# EAGLE schematic marionette (EAGLE 7.7.0), part 1 of 2
VERSION: 2.2

## Sheet 1 of 4: PWR
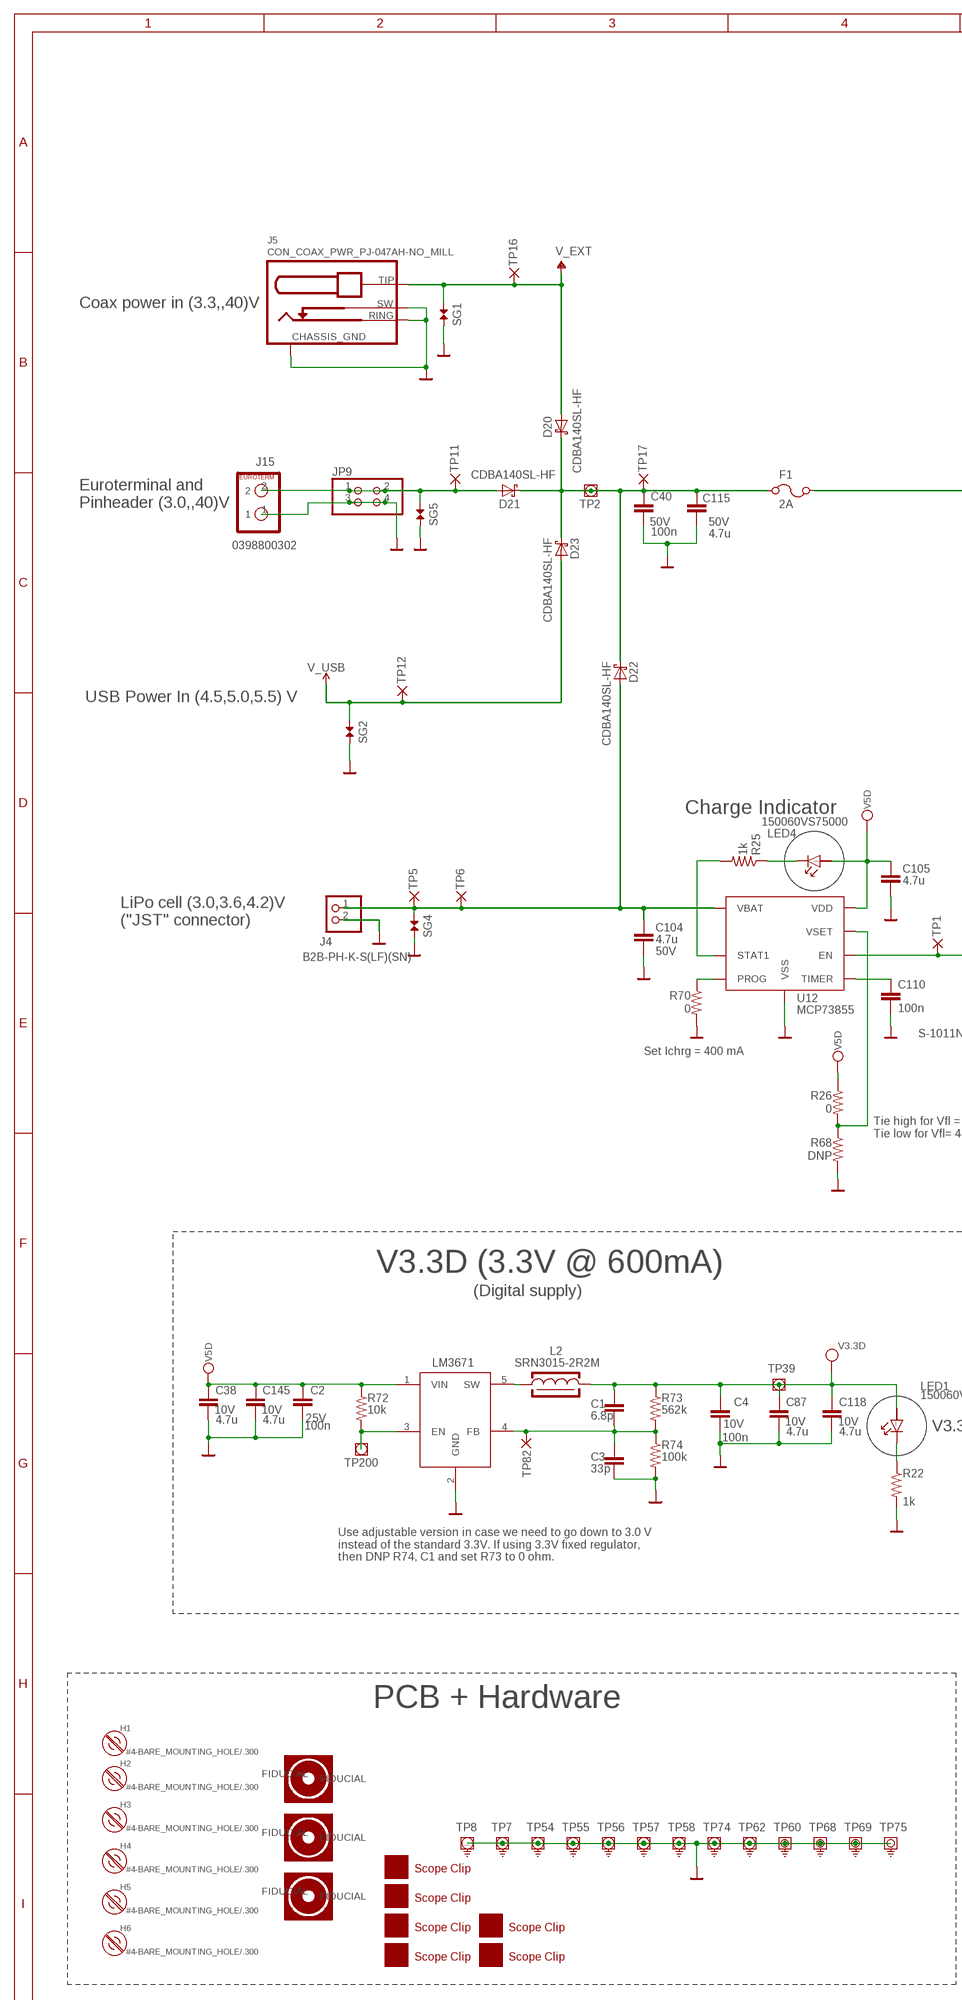
[diagram p0: schematic, sheet 1, part 1 of 2]
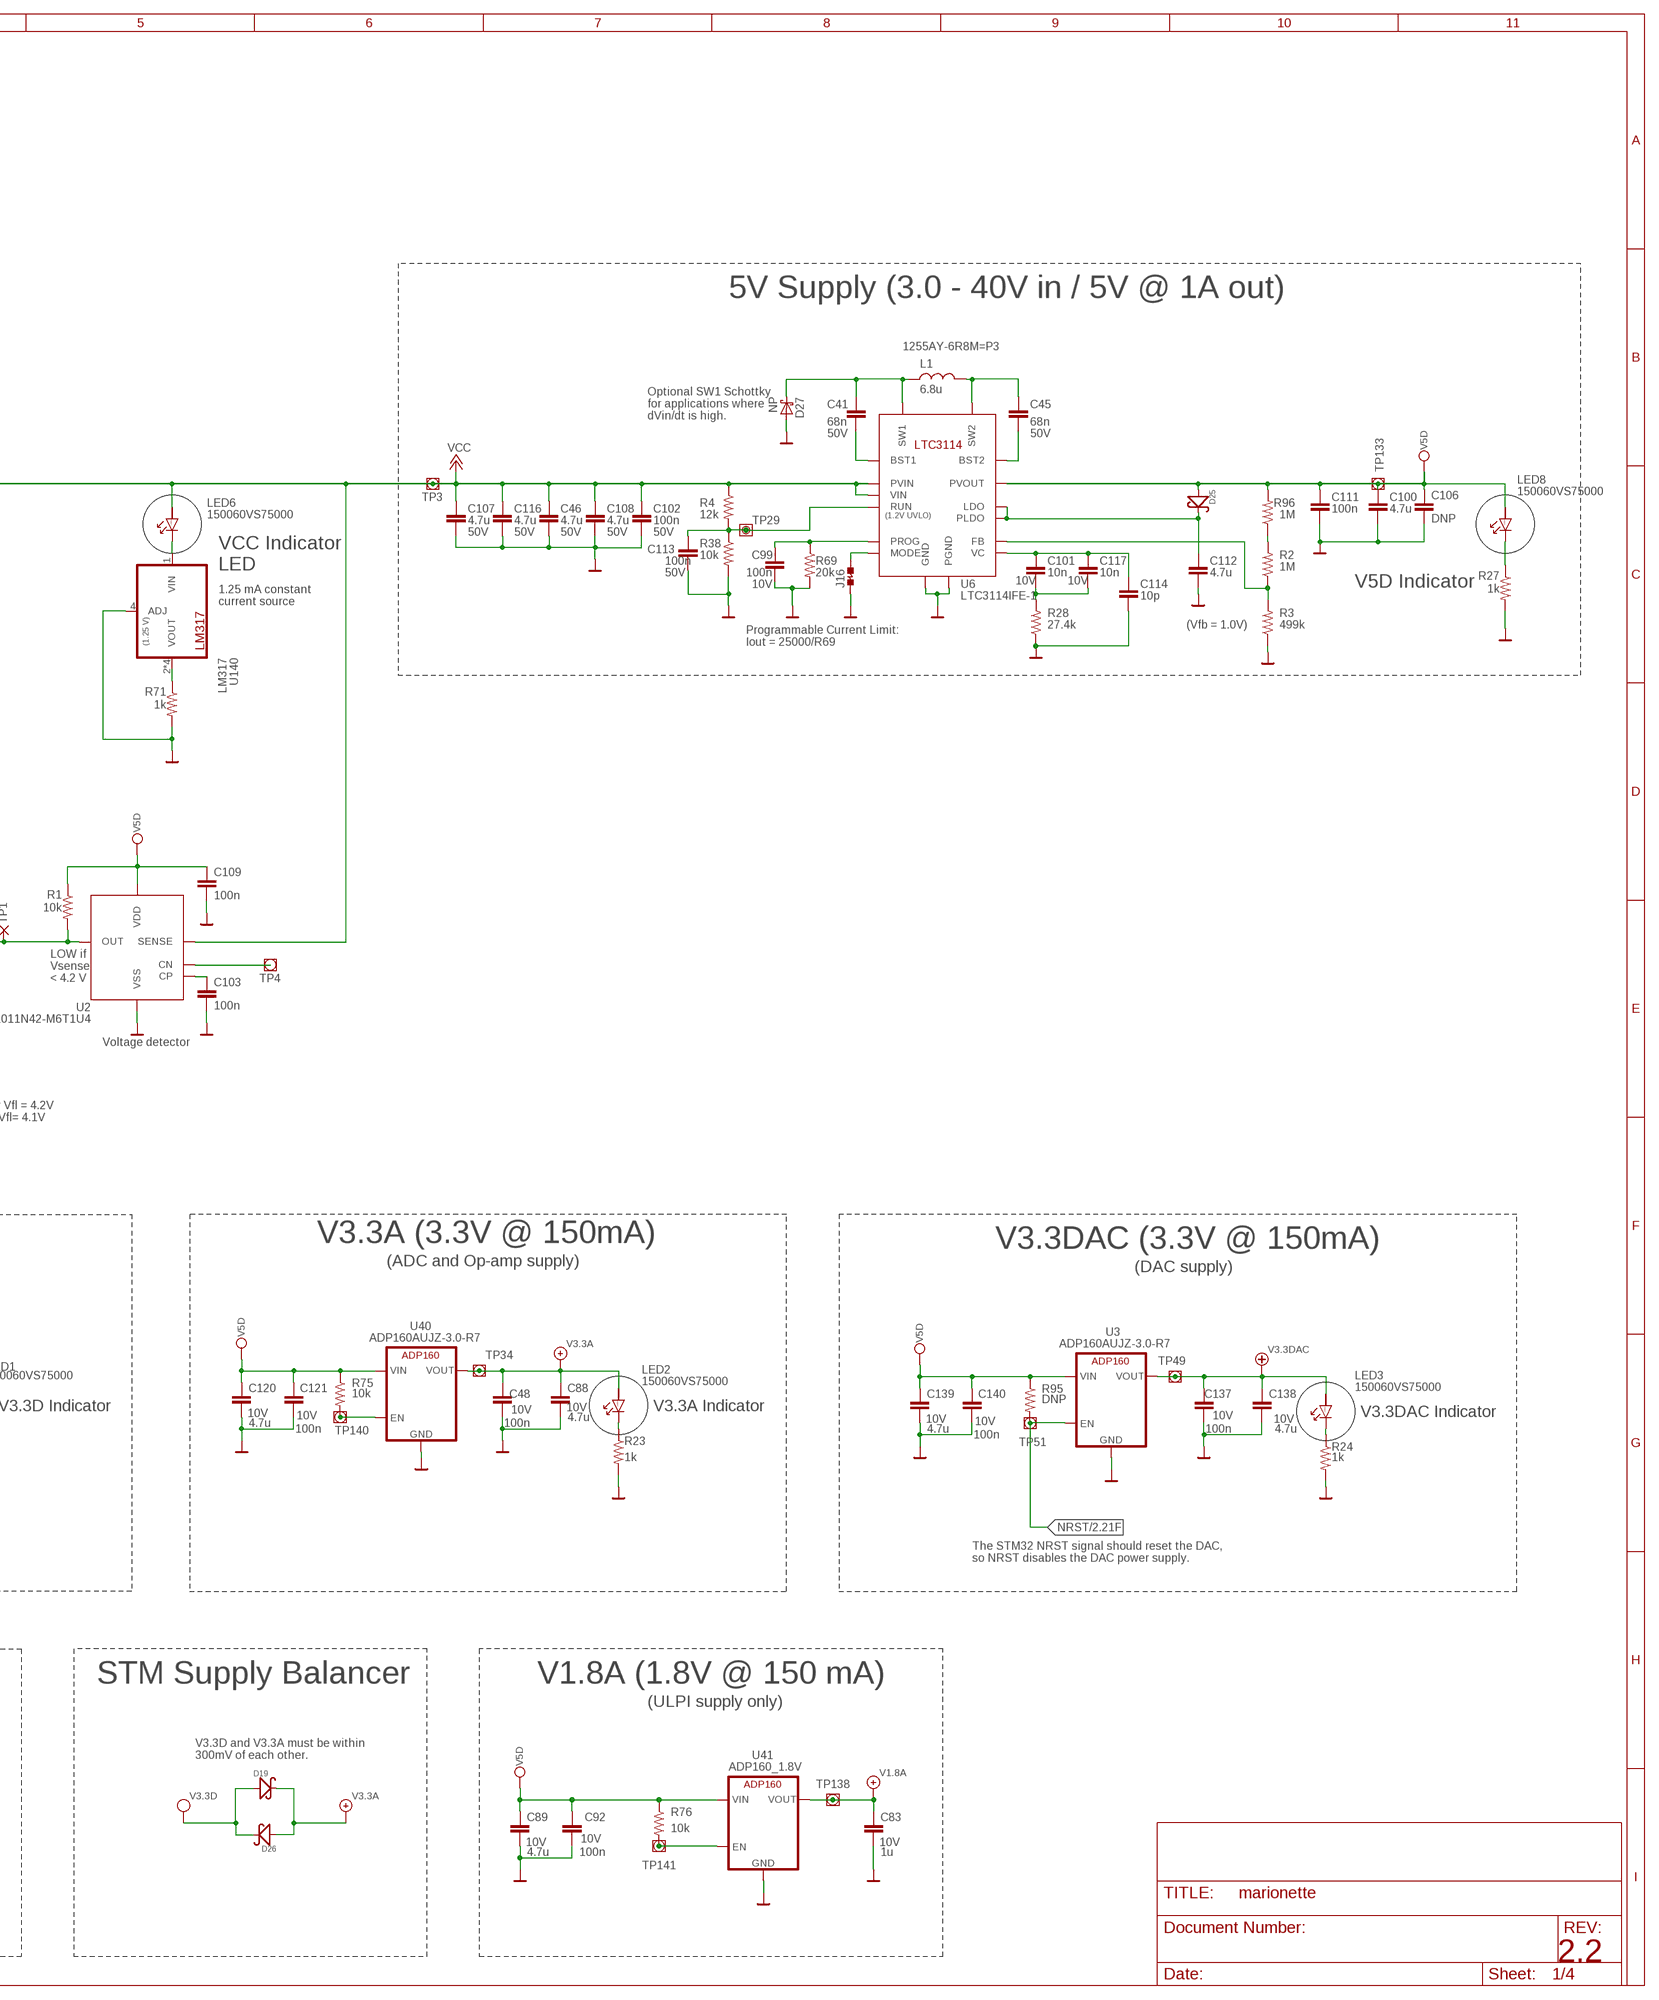
[diagram p1: schematic, sheet 1, part 2 of 2]

### Parts
C1  6.8p  C-EU0402-B  [.0402-B]
C2  100n  C-EU0402-B  [.0402-B]
C3  33p  C-EU0402-B  [.0402-B]
C4  100n  C-EU0402-B  [.0402-B]
C38  4.7u  C-EU0805-B  [.0805-B]
C40  100n  C-EU0402-B  [.0402-B]
C41  68n  C-EU0402-B  [.0402-B]
C45  68n  C-EU0402-B  [.0402-B]
C46  4.7u  C-EU0805-B  [.0805-B]
C48  100n  C-EU0402-B  [.0402-B]
C83  1u  C-EU0402-B  [.0402-B]
C87  4.7u  C-EU0805-B  [.0805-B]
C88  4.7u  C-EU0805-B  [.0805-B]
C89  4.7u  C-EU0805-B  [.0805-B]
C92  100n  C-EU0402-B  [.0402-B]
C99  100n  C-EU0402-B  [.0402-B]
C100  4.7u  C-EU0805-B  [.0805-B]
C101  10n  C-EU0402-B  [.0402-B]
C102  100n  C-EU0402-B  [.0402-B]
C103  100n  C-EU0402-B  [.0402-B]
C104  4.7u  C-EU0805-B  [.0805-B]
C105  4.7u  C-EU0805-B  [.0805-B]
C106  DNP  C-EU1206-B  [1206-B]
C107  4.7u  C-EU0805-B  [.0805-B]
C108  4.7u  C-EU0805-B  [.0805-B]
C109  100n  C-EU0402-B  [.0402-B]
C110  100n  C-EU0402-B  [.0402-B]
C111  100n  C-EU0402-B  [.0402-B]
C112  4.7u  C-EU0805-B  [.0805-B]
C113  100n  C-EU0402-B  [.0402-B]
C114  10p  C-EU0402-B  [.0402-B]
C115  4.7u  C-EU0805-B  [.0805-B]
C116  4.7u  C-EU0805-B  [.0805-B]
C117  10n  C-EU0402-B  [.0402-B]
C118  4.7u  C-EU0805-B  [.0805-B]
C120  4.7u  C-EU0805-B  [.0805-B]
C121  100n  C-EU0402-B  [.0402-B]
C137  100n  C-EU0402-B  [.0402-B]
C138  4.7u  C-EU0805-B  [.0805-B]
C139  4.7u  C-EU0805-B  [.0805-B]
C140  100n  C-EU0402-B  [.0402-B]
C145  4.7u  C-EU0805-B  [.0805-B]
D19  VSKY05201006-G4-08  DIODE-SCHOTTKY-0402  [.0402-B-NOSILK-DIODE]
D20  CDBA140SL-HF  DIODE_SCHOTTKY-_CDBA140SL-HF  [SMA]
D21  CDBA140SL-HF  DIODE_SCHOTTKY-_CDBA140SL-HF  [SMA]
D22  CDBA140SL-HF  DIODE_SCHOTTKY-_CDBA140SL-HF  [SMA]
D23  CDBA140SL-HF  DIODE_SCHOTTKY-_CDBA140SL-HF  [SMA]
D25  VSKY05201006-G4-08  DIODE-SCHOTTKY-0402  [.0402-B-NOSILK-DIODE]
D26  VSKY05201006-G4-08  DIODE-SCHOTTKY-0402  [.0402-B-NOSILK-DIODE]
D27  NP  DIODE_SCHOTTKY-_B130LB  [SMB]
F1  2A  FUSE-C1Q2  [R1206]
FIDUCIAL2  FIDUCIAL-1.0X2.0  [FIDUCIAL-1.0X2.0]
FIDUCIAL3  FIDUCIAL-1.0X2.0  [FIDUCIAL-1.0X2.0]
FIDUCIAL6  FIDUCIAL-1.0X2.0  [FIDUCIAL-1.0X2.0]
H1  #4-BARE_MOUNTING_HOLE/.300  [#4/.300-BARE+STD_NUT_OR_STAR_WASHER]
H2  #4-BARE_MOUNTING_HOLE/.300  [#4/.300-BARE+STD_NUT_OR_STAR_WASHER]
H3  #4-BARE_MOUNTING_HOLE/.300  [#4/.300-BARE+STD_NUT_OR_STAR_WASHER]
H4  #4-BARE_MOUNTING_HOLE/.300  [#4/.300-BARE+STD_NUT_OR_STAR_WASHER]
H5  #4-BARE_MOUNTING_HOLE/.300  [#4/.300-BARE+STD_NUT_OR_STAR_WASHER]
H6  #4-BARE_MOUNTING_HOLE/.300  [#4/.300-BARE+STD_NUT_OR_STAR_WASHER]
J4  B2B-PH-K-S(LF)(SN)  JST_2PIN-THM  [JST-PH-2-THM]
J5  CON_COAX_PWR_PJ-047AH-NO_MILL  [PJ-047_NO_MILLED_SLOTS]
J15  0398800302  CONN-TERM-EUROTERM_200MIL_2X1  [CONN-TERM-EUROSTYLE_200MIL_2X1]
J16  JUMPER-SHORTED-CUTTABLE-E0402-0.3MM-NOSILK  [JUMPER-SHORTED-CUTTABLE-E0402-0.3MM-NOSILK]
J17  SCOPE_CLIP_5MM_10MM  [SCOPE_CLIP_5MM_10MM]
J18  SCOPE_CLIP_5MM_10MM  [SCOPE_CLIP_5MM_10MM]
J19  SCOPE_CLIP_5MM_10MM  [SCOPE_CLIP_5MM_10MM]
J20  SCOPE_CLIP_5MM_10MM  [SCOPE_CLIP_5MM_10MM]
J24  SCOPE_CLIP_5MM_10MM  [SCOPE_CLIP_5MM_10MM]
J25  SCOPE_CLIP_5MM_10MM  [SCOPE_CLIP_5MM_10MM]
JP9  PINHD-2X2  [2X02]
L1  6.8u  L-US_1255AY_MURATA  [L_SHIELDED_6.3MM_6.3MM_4.5MM]
L2  SRN3015-2R2M  INDUCTOR_FERRITE_CORE_SRN3015-2R2M  [INDUCTOR_3MM_3MM_1.5MM]
LED1  150060VS75000  LS_Q976  [CHIPLED_0603]
LED2  150060VS75000  LS_Q976  [CHIPLED_0603]
LED3  150060VS75000  LS_Q976  [CHIPLED_0603]
LED4  150060VS75000  LS_Q976  [CHIPLED_0603]
LED6  150060VS75000  LS_Q976  [CHIPLED_0603]
LED8  150060VS75000  LS_Q976  [CHIPLED_0603]
R1  10k  R-US_0402-B  [.0402-B]
R2  1M  R-US_0402-B  [.0402-B]
R3  499k  R-US_0402-B  [.0402-B]
R4  12k  R-US_0402-B  [.0402-B]
R22  1k  R-US_0402-B  [.0402-B]
R23  1k  R-US_0402-B  [.0402-B]
R24  1k  R-US_0402-B  [.0402-B]
R25  1k  R-US_0402-B  [.0402-B]
R26  0  R-US_0402-B  [.0402-B]
R27  1k  R-US_0402-B  [.0402-B]
R28  27.4k  R-US_0402-B  [.0402-B]
R38  10k  R-US_0402-B  [.0402-B]
R68  DNP  R-US_0402-B  [.0402-B]
R69  20k  R-US_0402-B  [.0402-B]
R70  0  R-US_0402-B  [.0402-B]
R71  1k  R-US_0402-B  [.0402-B]
R72  10k  R-US_0402-B  [.0402-B]
R73  562k  R-US_0402-B  [.0402-B]
R74  100k  R-US_0402-B  [.0402-B]
R75  10k  R-US_0402-B  [.0402-B]
R76  10k  R-US_0402-B  [.0402-B]
R95  DNP  R-US_0402-B  [.0402-B]
R96  1M  R-US_0402-B  [.0402-B]
SG1  SPARKGAP_RECT_0.15MM  [SPARKGAP_0.15MM]
SG2  SPARKGAP_RECT_0.15MM  [SPARKGAP_0.15MM]
SG4  SPARKGAP_RECT_0.15MM  [SPARKGAP_0.15MM]
SG5  SPARKGAP_RECT_0.15MM  [SPARKGAP_0.15MM]
TP1  PAD+X-1.0-NO_CREAM+SILK  [PAD-ROUND-1.0-NOCREAM+SILK]
TP2  PAD+VIA_0.6MM  [PAD+VIA_0.6MM]
TP3  PAD+VIA_0.6MM  [PAD+VIA_0.6MM]
TP4  PAD+VIA_0.6MM  [PAD+VIA_0.6MM]
TP5  PAD+X-1.0-NO_CREAM+SILK  [PAD-ROUND-1.0-NOCREAM+SILK]
TP6  PAD+X-1.0-NO_CREAM+SILK  [PAD-ROUND-1.0-NOCREAM+SILK]
TP7  PAD+VIA_GND_0.6MM  [PAD+GND_VIA_0.6MM]
TP8  PAD+VIA_GND_0.6MM  [PAD+GND_VIA_0.6MM]
TP11  PAD+X-1.0-NO_CREAM+SILK  [PAD-ROUND-1.0-NOCREAM+SILK]
TP12  PAD+X-1.0-NO_CREAM+SILK  [PAD-ROUND-1.0-NOCREAM+SILK]
TP16  PAD+X-1.0-NO_CREAM+SILK  [PAD-ROUND-1.0-NOCREAM+SILK]
TP17  PAD+X-1.0-NO_CREAM+SILK  [PAD-ROUND-1.0-NOCREAM+SILK]
TP29  PAD+VIA_0.25MM  [PAD+VIA_0.25MM]
TP34  PAD+VIA_0.6MM  [PAD+VIA_0.6MM]
TP39  PAD+VIA_0.6MM  [PAD+VIA_0.6MM]
TP49  PAD+VIA_0.6MM  [PAD+VIA_0.6MM]
TP51  PAD+VIA_0.6MM  [PAD+VIA_0.6MM]
TP54  PAD+VIA_GND_0.6MM  [PAD+GND_VIA_0.6MM]
TP55  PAD+VIA_GND_0.6MM  [PAD+GND_VIA_0.6MM]
TP56  PAD+VIA_GND_0.6MM  [PAD+GND_VIA_0.6MM]
TP57  PAD+VIA_GND_0.6MM  [PAD+GND_VIA_0.6MM]
TP58  PAD+VIA_GND_0.6MM  [PAD+GND_VIA_0.6MM]
TP60  PAD+VIA_GND_0.25MM  [PAD+GND_VIA_0.25MM]
TP62  PAD+VIA_GND_0.6MM  [PAD+GND_VIA_0.6MM]
TP68  PAD+VIA_GND_0.25MM  [PAD+GND_VIA_0.25MM]
TP69  PAD+VIA_GND_0.25MM  [PAD+GND_VIA_0.25MM]
TP74  PAD+VIA_GND_0.6MM  [PAD+GND_VIA_0.6MM]
TP75  PAD+VIA_GND_0.25MM  [PAD+GND_VIA_0.25MM]
TP82  PAD+X-0.7-NO_CREAM+SILK  [PAD-ROUND-0.7-NOCREAM+SILK]
TP133  PAD+VIA_0.6MM  [PAD+VIA_0.6MM]
TP138  PAD+VIA_0.6MM  [PAD+VIA_0.6MM]
TP140  PAD+VIA_0.6MM  [PAD+VIA_0.6MM]
TP141  PAD+VIA_0.6MM  [PAD+VIA_0.6MM]
TP200  PAD+VIA_0.6MM  [PAD+VIA_0.6MM]
U2  S-1011N42-M6T1U4  S-1011N  [SOT23-6]
U3  ADP160AUJZ-3.0-R7  ADP160_3.3V  [SOT23-5]
U6  LTC3114IFE-1  LTC3114FE  [16-LEAD-PLASTIC-TSSOP-FE]
U12  MCP73855  [10-LEAD-DFN]
U17  LM3671  [SOT23-5L]
U40  ADP160AUJZ-3.0-R7  ADP160_3.3V  [SOT23-5]
U41  ADP160_1.8V  [SOT23-5]
U140  LM317  [SOIC-8]

### Nets
BST1: C41.1 U6.13(BST1)
BST2: C45.1 U6.12(BST2)
CHG-ENABLE: R1.2 TP1.PAD(P) U2.3(OUT) U12.10(EN)
CHRG_IND_CATHODE: LED4.C R25.1
CN: TP4.TP U2.6(CN)
CP: C103.1 U2.4(CP)
GND: C2.1 C3.1 C4.1 C38.2 C40.2 C46.2 C48.1 C83.2 C87.2 C88.2 C89.2 C92.1 C99.1 C100.2 C102.1 C103.2 C104.2 C105.2 C106.2 C107.2 C108.2 C109.2 C110.2 C111.1 C112.2 C113.1 C114.1 C115.2 C116.2 C118.2 C120.2 C121.1 C137.1 C138.2 C139.2 C140.1 C145.2 D27.ANODE J4.2 J5.RING J5.S1(CHASSIS_GND) J5.S2(CHASSIS_GND) J5.SWITCH(SW) J15.1 J16.1 JP9.3 JP9.4 R3.1 R22.2 R23.2 R24.2 R27.2 R28.1 R38.2 R68.2 R69.2 R70.2 R71.2 R74.2 SG1.2 SG2.2 SG4.2 SG5.2 TP7.TP TP8.TP TP54.TP TP55.TP TP56.TP TP57.TP TP58.TP TP60.TP TP62.TP TP68.TP TP69.TP TP74.TP TP75.TP U2.5(VSS) U3.2(GND) U3.4(GND) U6.1(PGND) U6.8(GND) U6.PAD(PGND) U12.4(VSS) U12.7(VSS) U12.EP(VSS) U17.2(GND) U40.2(GND) U40.4(GND) U41.2(GND) U41.4(GND) U140.4(ADJ) ; also sheet 2,3,4
LED_CATH_V3.3A: LED2.C R23.1
LED_CATH_V3.3D: LED1.C R22.1
LED_CATH_V3.3DAC: LED3.C R24.1
LM3671_EN: R72.2 TP200.TP U17.3(EN)
LM3671_FB: C1.1 C3.2 R73.2 R74.1 TP82.PAD(P) U17.4(FB)
LM3671_SW: L2.2 U17.5(SW)
LTC3114_FB: R2.1 R3.2 U6.7(FB)
LTC3114_LDO: C112.1 D25.C(-) U6.9(LDO) U6.11(PLDO)
LTC3114_MODE: J16.2 U6.16(MODE)
LTC3114_PROG: C99.2 R69.1 U6.5(PROG)
LTC3114_RUN: C113.2 R4.2 R38.1 TP29.TP U6.4(RUN)
LTC3114_VC: C101.2 C114.2 C117.2 U6.6(VC)
LTC3114_VC1: C101.1 C117.1 R28.2
MCP73855_PROG: R70.1 U12.5(PROG)
MCP73855_STAT1: R25.2 U12.1(STAT1)
MCP73855_VSET: R26.2 R68.1 U12.2(VSET)
MIC5305_V1.8A_EN: R76.2 TP141.TP U41.3(EN)
MIC5305_V3.3_EN: R75.2 TP140.TP U40.3(EN)
NRST: R95.2 TP51.TP U3.3(EN) ; also sheet 2
SW1: C41.2 D27.CATH(CATHODE) L1.1 U6.15(SW1)
SW2: C45.2 L1.2 U6.2(SW2)
TIMER: C110.1 U12.6(TIMER)
V1.8A: C83.1 TP138.TP U41.5(VOUT) ; also sheet 2,4
V3.3A: C48.2 C88.1 D19.C(-) D26.A(+) LED2.A TP34.TP U40.5(VOUT) ; also sheet 2,3,4
V3.3D: C1.2 C4.2 C87.1 C118.1 D19.A(+) D26.C(-) L2.1 LED1.A R73.1 TP39.TP ; also sheet 2,4
V3.3DAC: C137.2 C138.1 LED3.A TP49.TP U3.5(VOUT) ; also sheet 3
V5D: C2.2 C38.1 C89.1 C92.2 C100.1 C105.1 C106.1 C109.1 C111.2 C120.1 C121.2 C139.1 C140.2 C145.1 D25.A(+) LED4.A LED8.A R1.1 R26.1 R72.1 R75.1 R76.1 R95.1 R96.2 TP133.TP U2.1(VDD) U3.1(VIN) U6.3(PVOUT) U12.3(VDD) U17.1(VIN) U40.1(VIN) U41.1(VIN) ; also sheet 2,4
V5D_CATHODE: LED8.C R27.1
V5D_FB_R: R2.2 R96.1
V_EXT: D20.A(ANODE) J5.TIP SG1.1 TP16.PAD(P)
V_USB [med-isolate]: D23.A(ANODE) SG2.1 TP12.PAD(P) ; also sheet 2
VBAT: C104.1 D22.A(ANODE) J4.1 SG4.1 TP5.PAD(P) TP6.PAD(P) U12.8(VBAT) U12.9(VBAT)
VCC: C46.1 C102.2 C107.1 C108.1 C116.1 F1.2 LED6.A R4.1 TP3.TP U2.2(SENSE) U6.10(VIN) U6.14(PVIN) ; also sheet 4
VCC_CATHODE: LED6.C U140.1(VIN)
VCC_LED: R71.1 U140.2(VOUT) U140.3(VOUT) U140.6(VOUT) U140.7(VOUT)
VIN [med-isolate]: C40.1 C115.1 D20.K(CATHODE) D21.K(CATHODE) D22.K(CATHODE) D23.K(CATHODE) F1.1 TP2.TP TP17.PAD(P)
VIN_EUROTERMINAL [med-isolate]: D21.A(ANODE) J15.2 JP9.1 JP9.2 SG5.1 TP11.PAD(P)
Unconnected: FIDUCIAL2.FIDUCIAL FIDUCIAL3.FIDUCIAL FIDUCIAL6.FIDUCIAL

### Notes on the sheet
- 5V Supply (3.0 - 40V in / 5V @ 1A out)
- Coax power in (3.3,,40)V
- 1255AY-6R8M=P3
- Optional SW1 Schottky 
  for applications where 
  dVin/dt is high.
- Euroterminal and 
  Pinheader (3.0,,40)V
- (1.2V UVLO)
- VCC Indicator
  LED
- V5D Indicator
- 1.25 mA constant
  current source
- (Vfb = 1.0V)
- Programmable Current Limit:
  Iout = 25000/R69
- USB Power In (4.5,5.0,5.5) V
- Charge Indicator
- LiPo cell (3.0,3.6,4.2)V
  ("JST" connector)
- LOW if 
  Vsense 
  < 4.2 V
- Set Ichrg = 400 mA
- Voltage detector
- Tie high for Vfl = 4.2V
  Tie low for Vfl= 4.1V
- V3.3A (3.3V @ 150mA) | V3.3DAC (3.3V @ 150mA)
- V3.3D (3.3V @ 600mA)
- (ADC and Op-amp supply)
- (DAC supply)
- (Digital supply)
- V3.3D Indicator | V3.3A Indicator
- V3.3DAC Indicator
- Use adjustable version in case we need to go down to 3.0 V
  instead of the standard 3.3V. If using 3.3V fixed regulator,
  then DNP R74, C1 and set R73 to 0 ohm.
- The STM32 NRST signal should reset the DAC, 
  so NRST disables the DAC power supply.
- PCB + Hardware | STM Supply Balancer | V1.8A (1.8V @ 150 mA)
- (ULPI supply only)
- V3.3D and V3.3A must be within
  300mV of each other.

## Sheet 2 of 4: STM
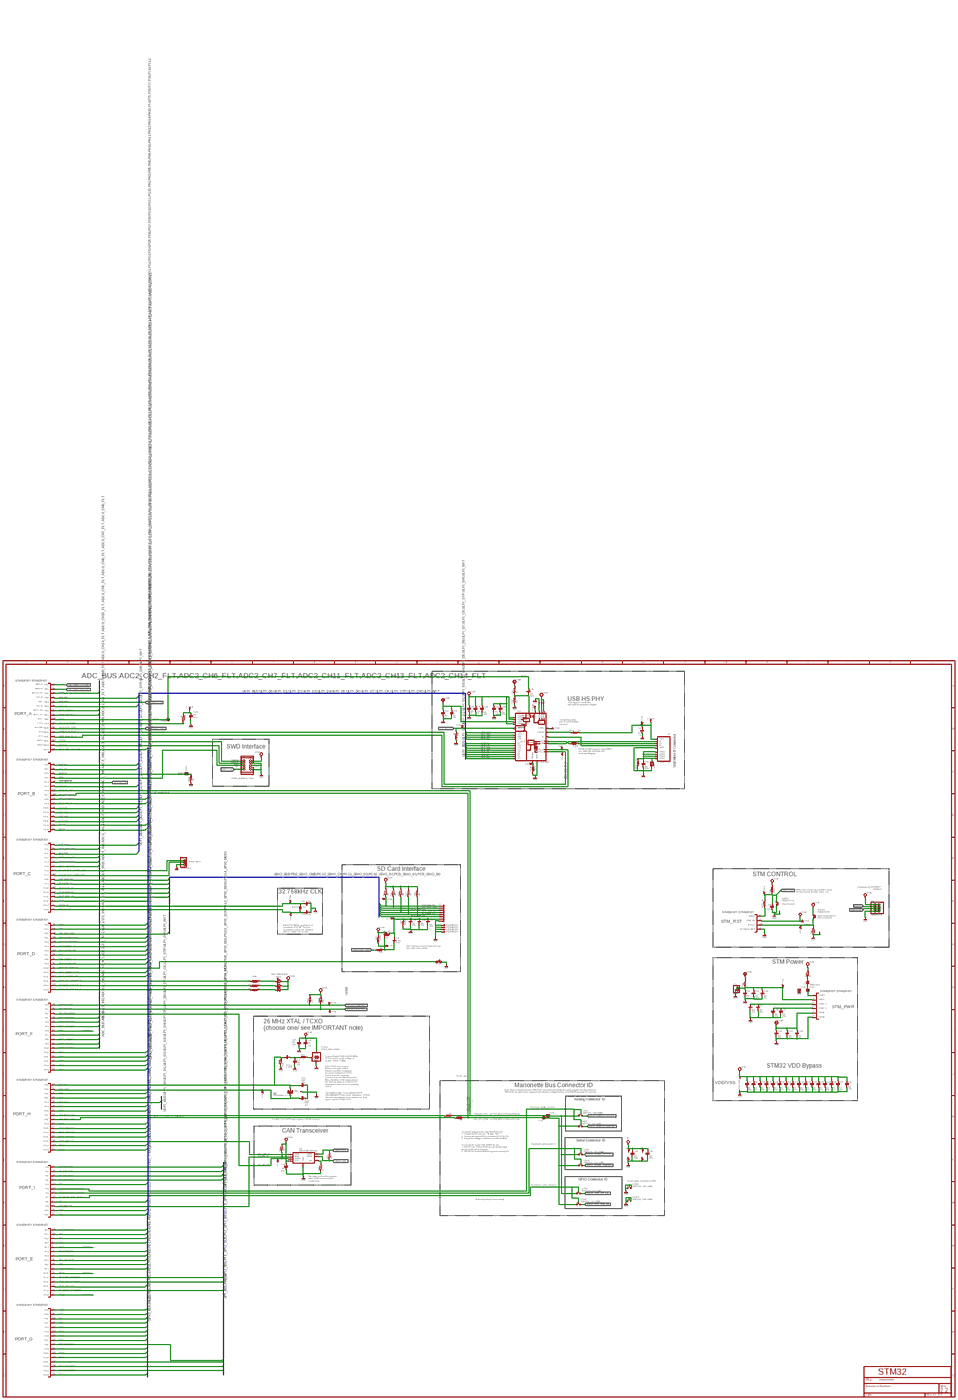
[diagram p2: schematic, sheet 2, overview]
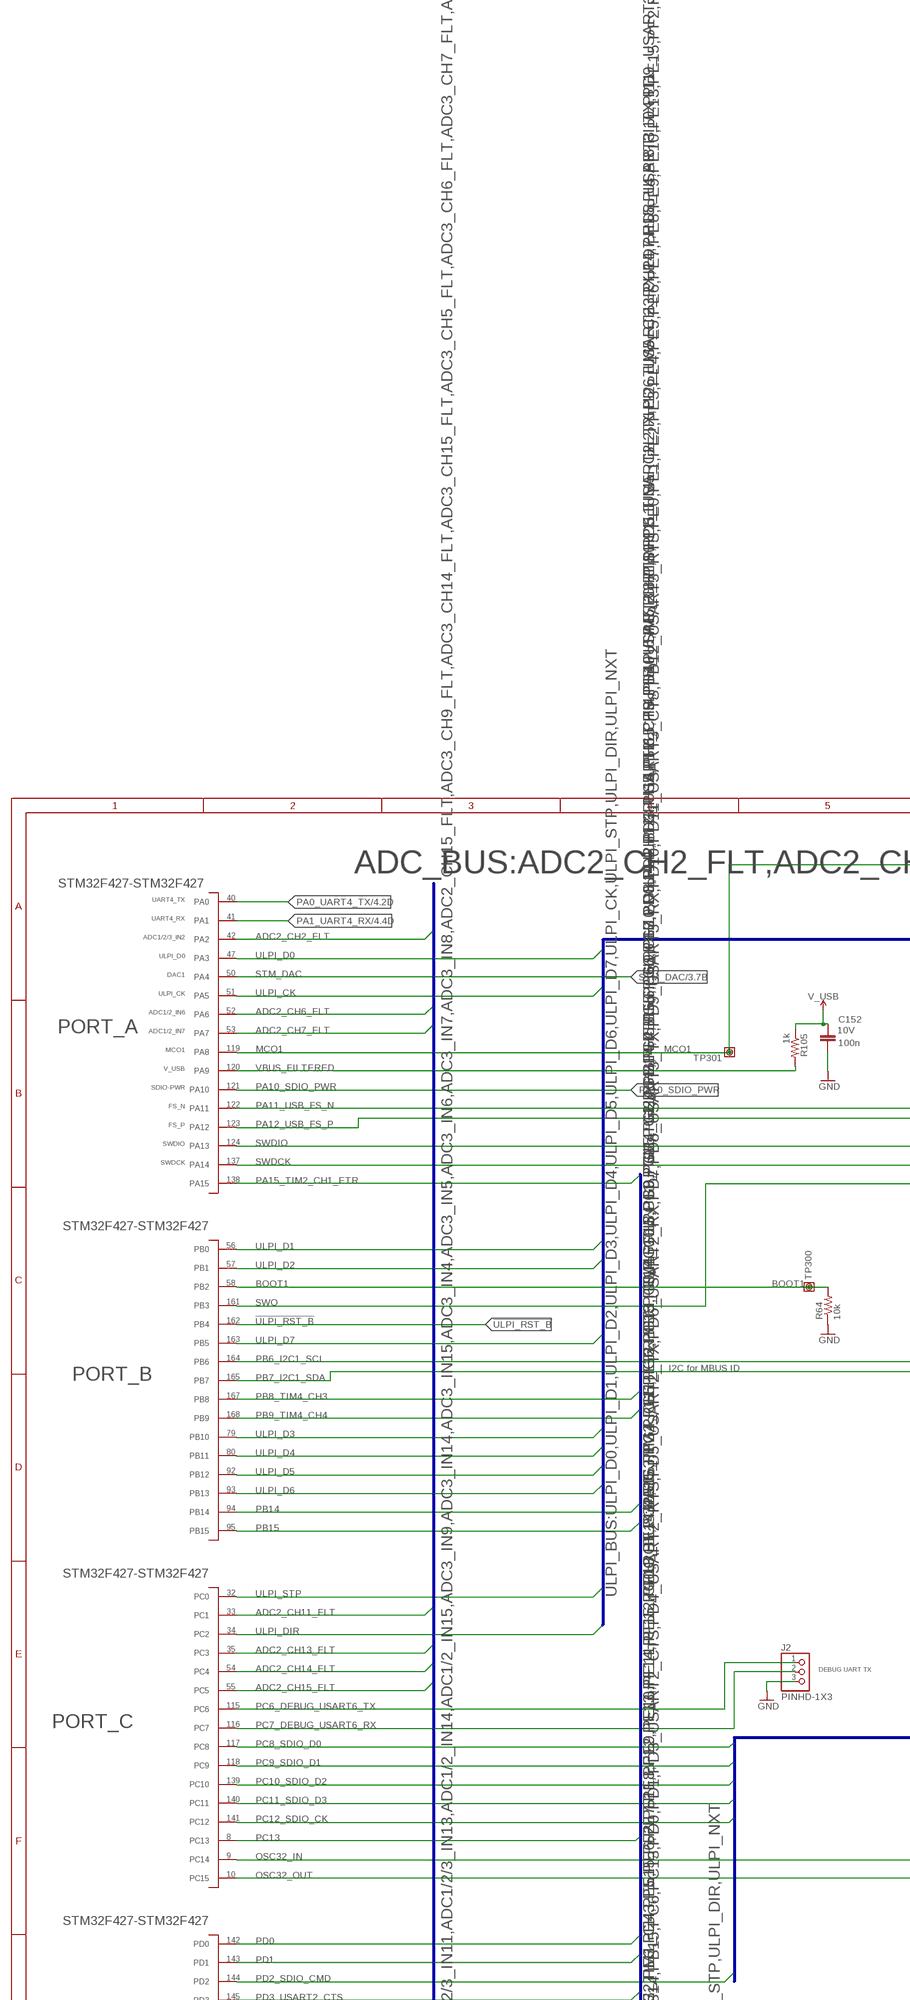
[diagram p3: schematic, sheet 2, part 1 of 6]
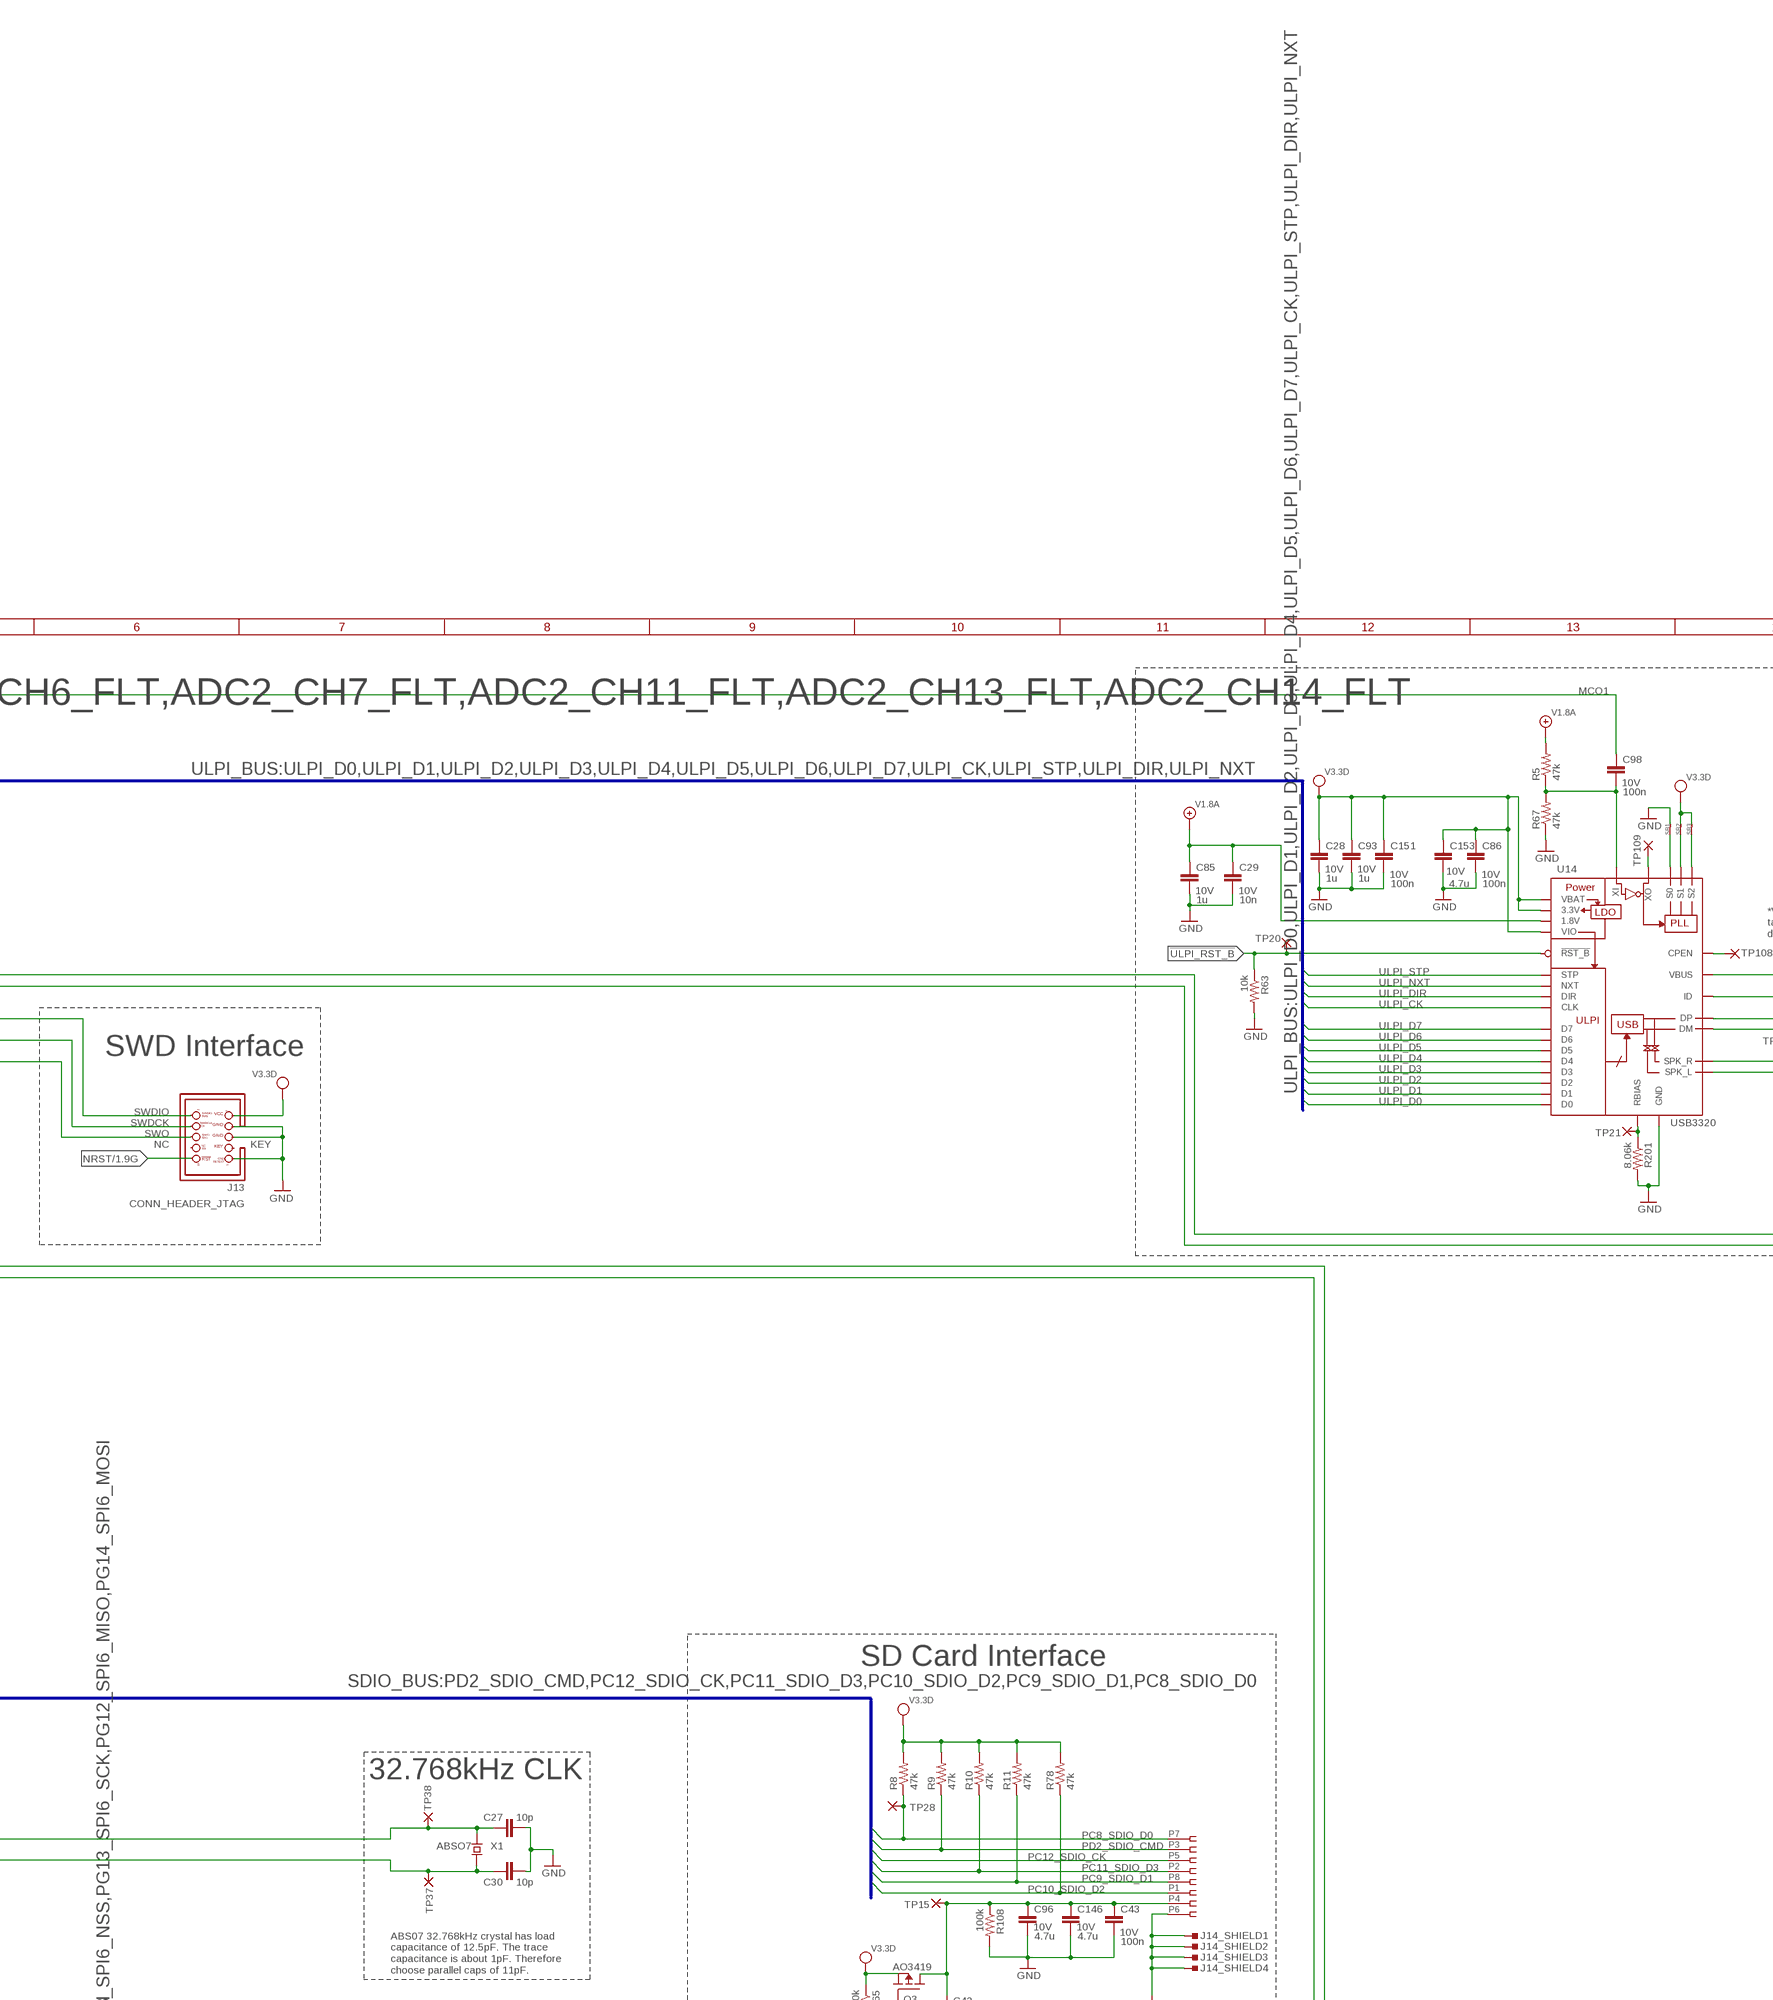
[diagram p4: schematic, sheet 2, part 2 of 6]
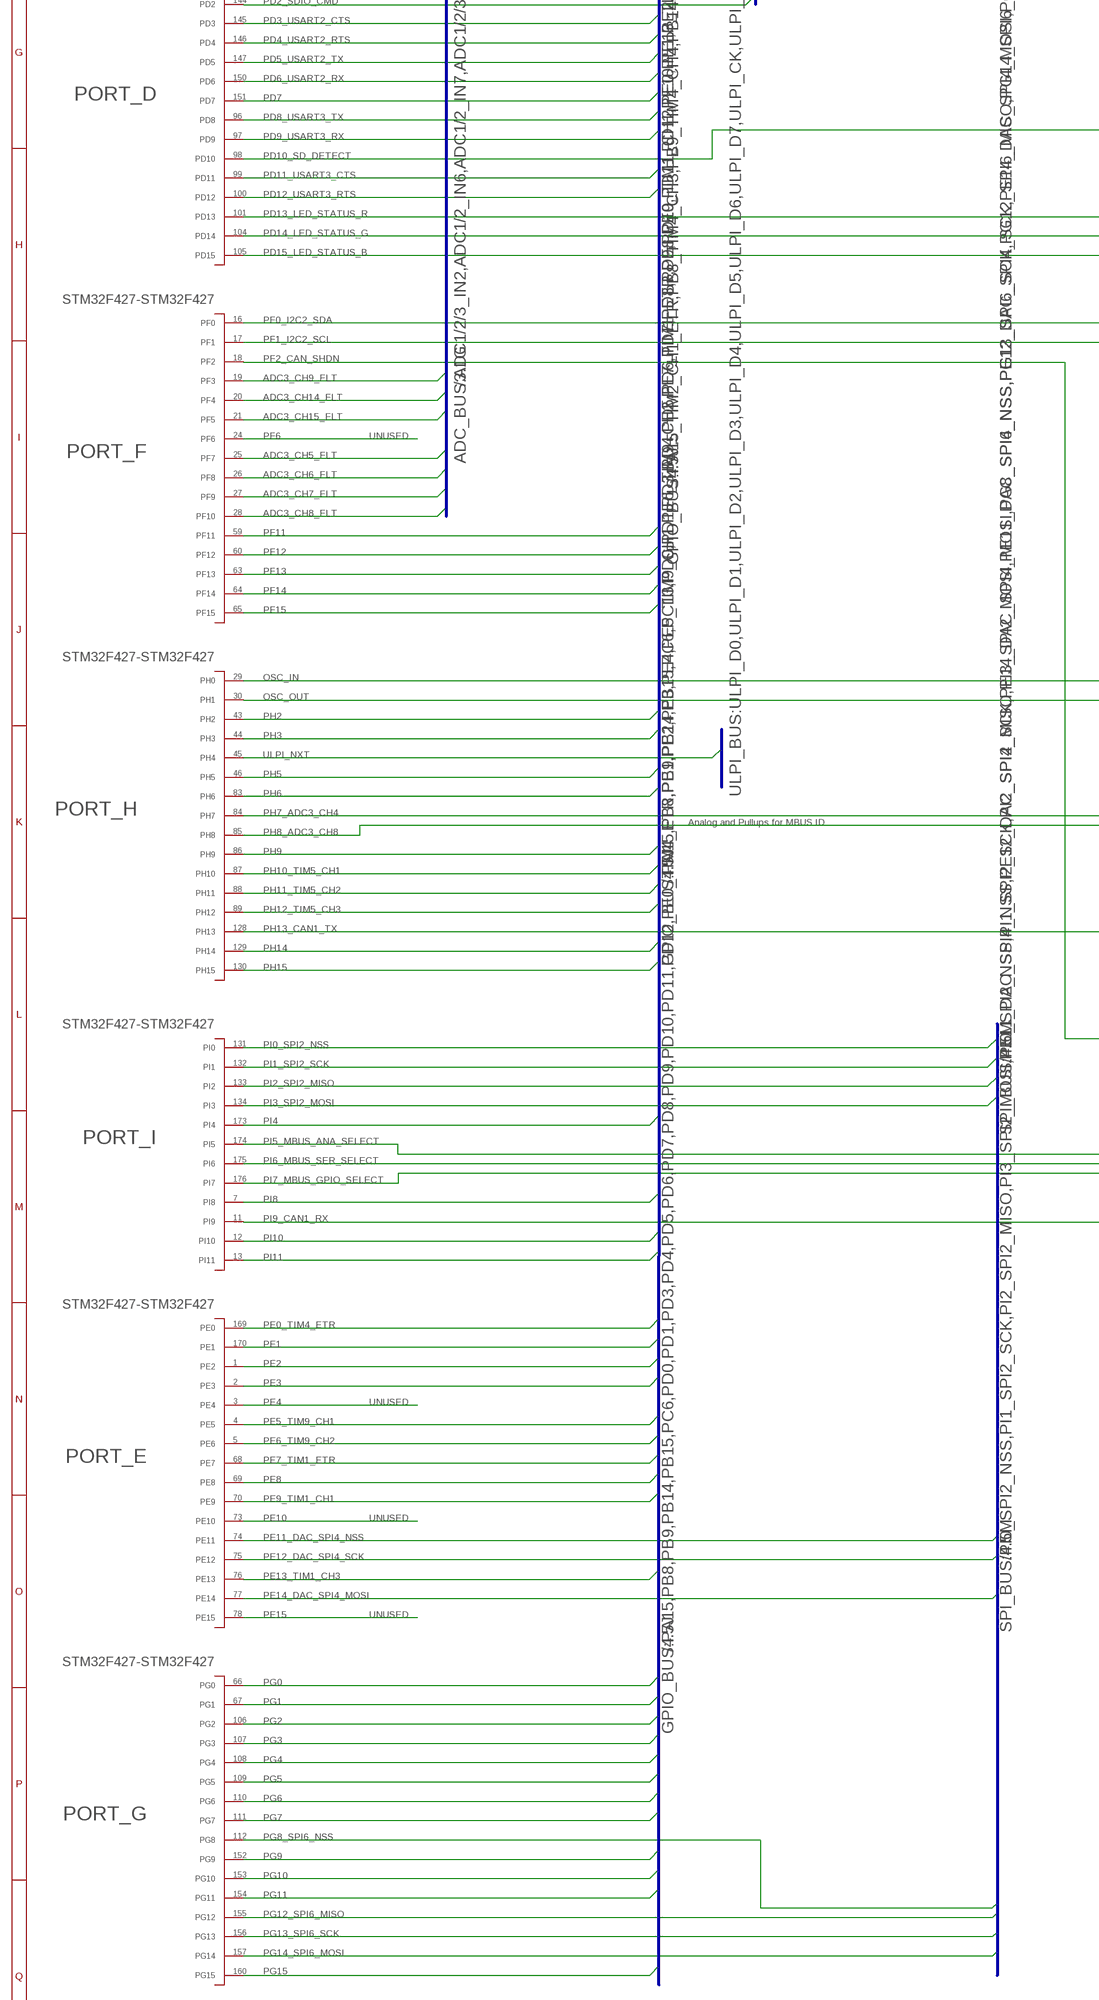
[diagram p5: schematic, sheet 2, part 3 of 6]
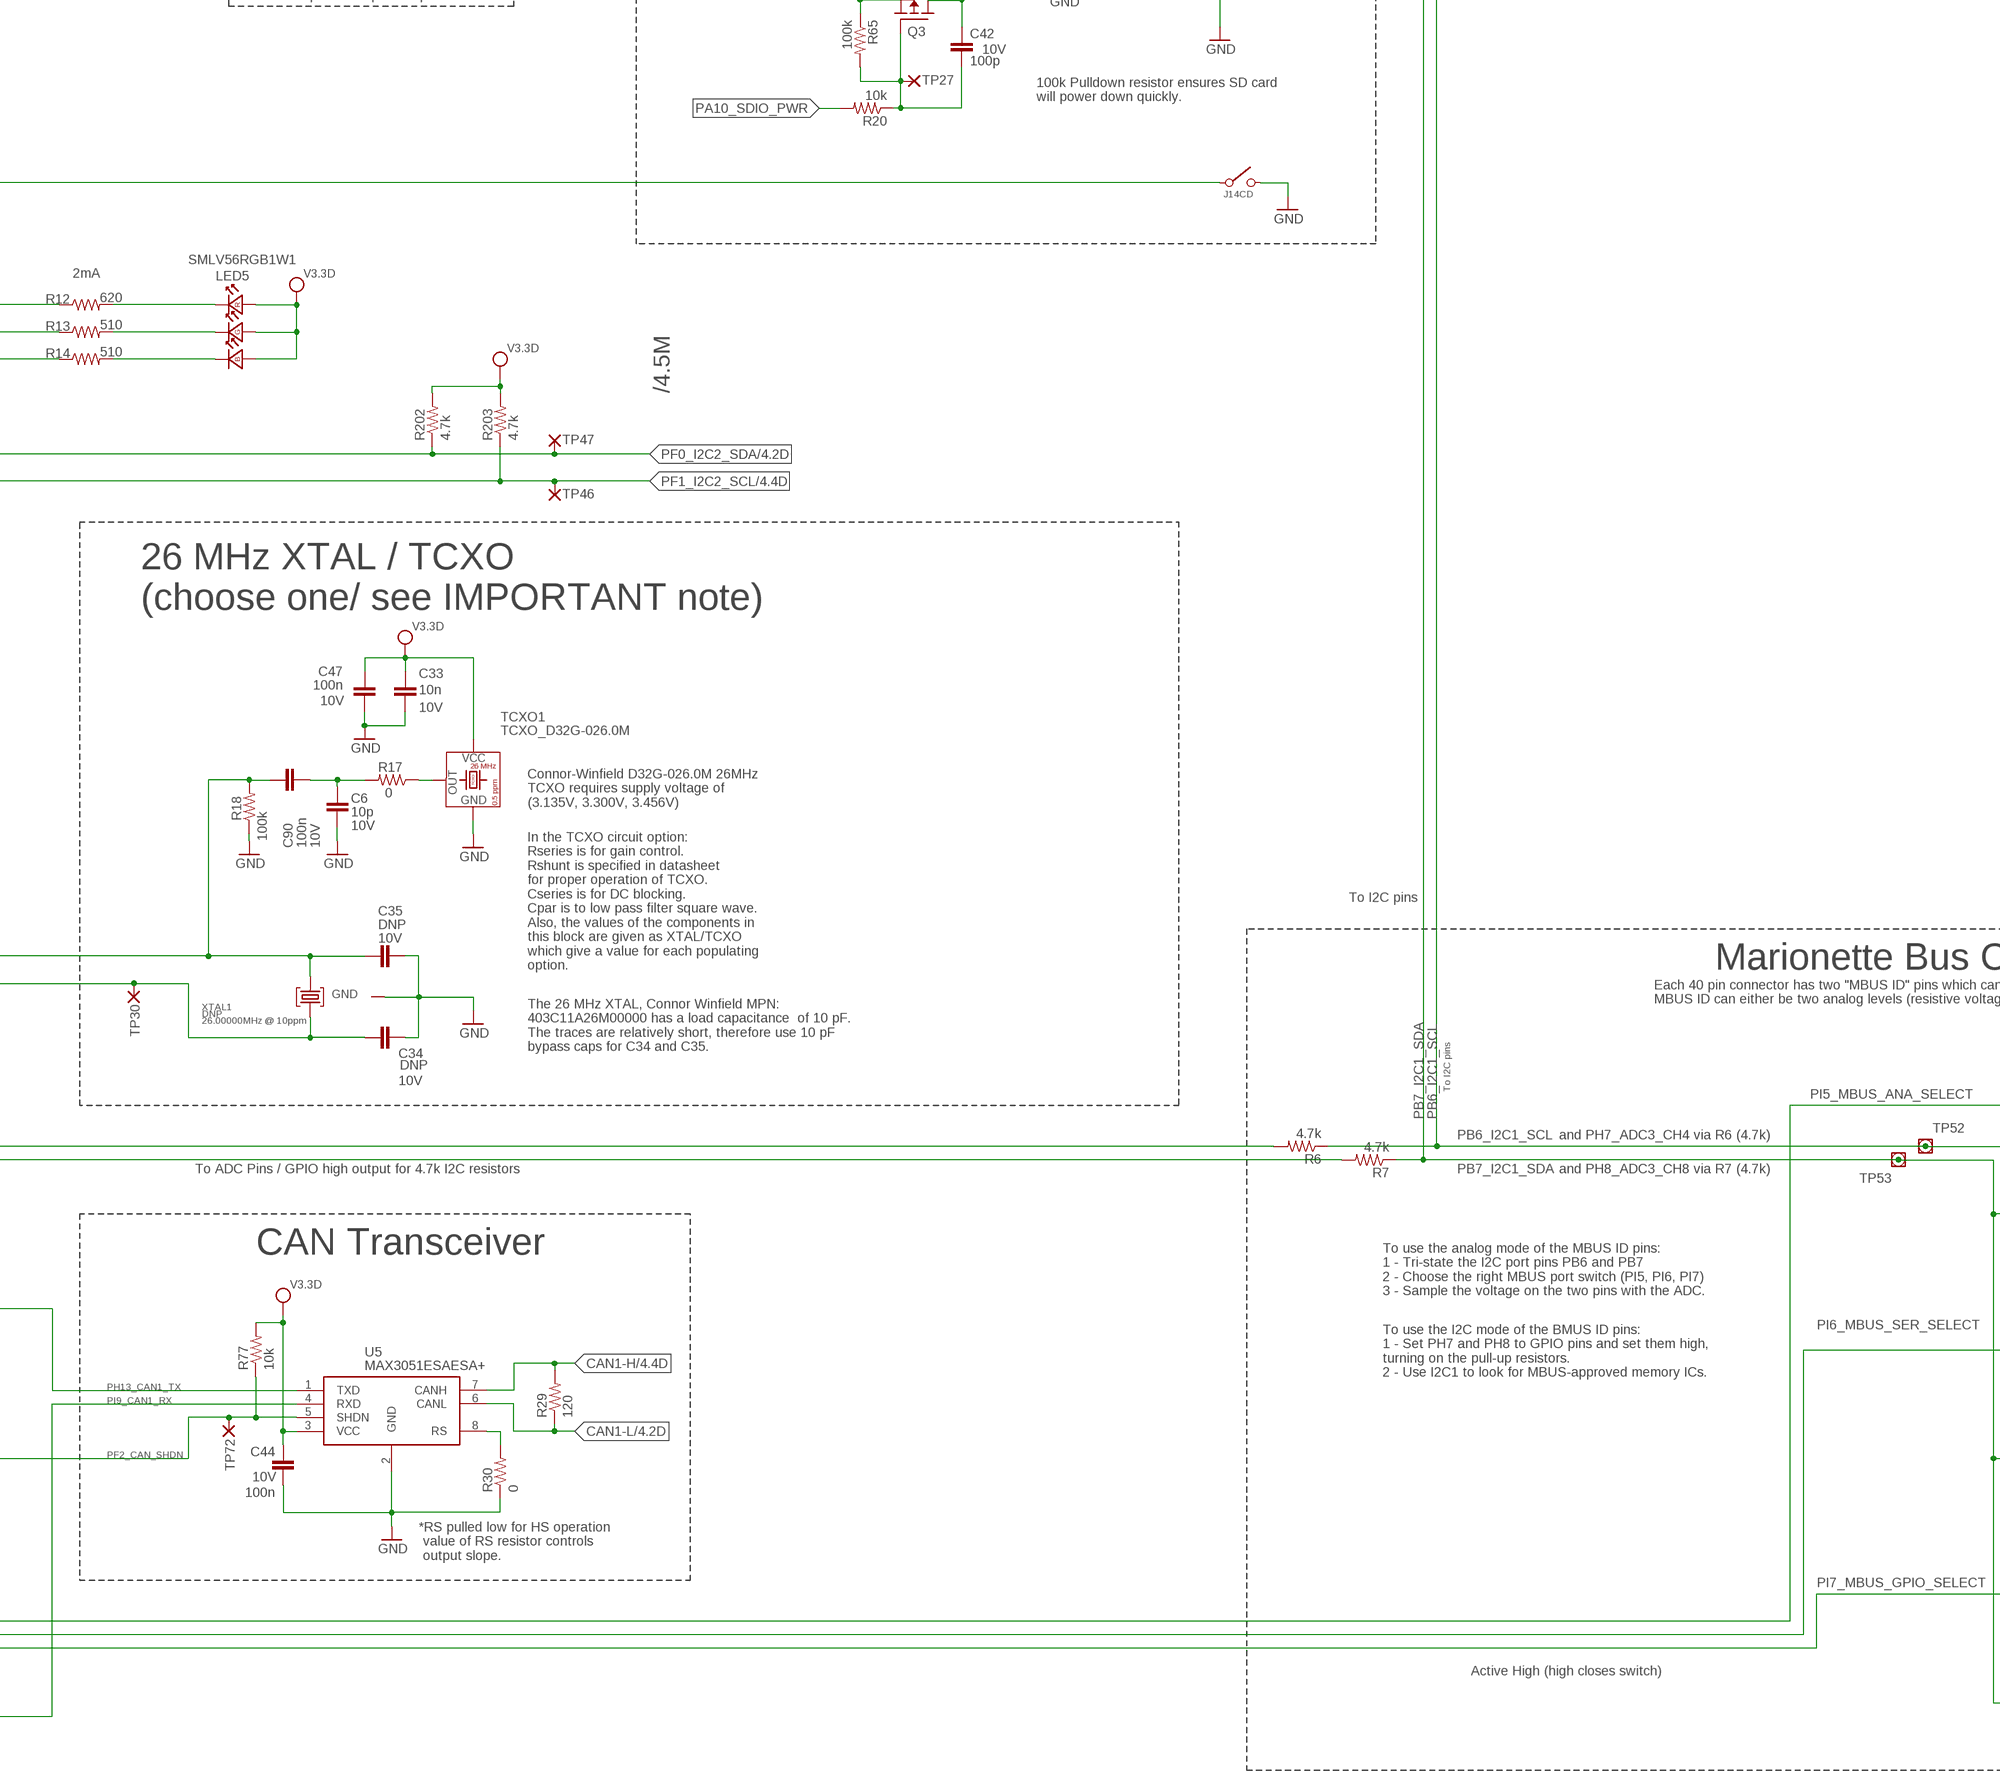
[diagram p6: schematic, sheet 2, part 4 of 6]
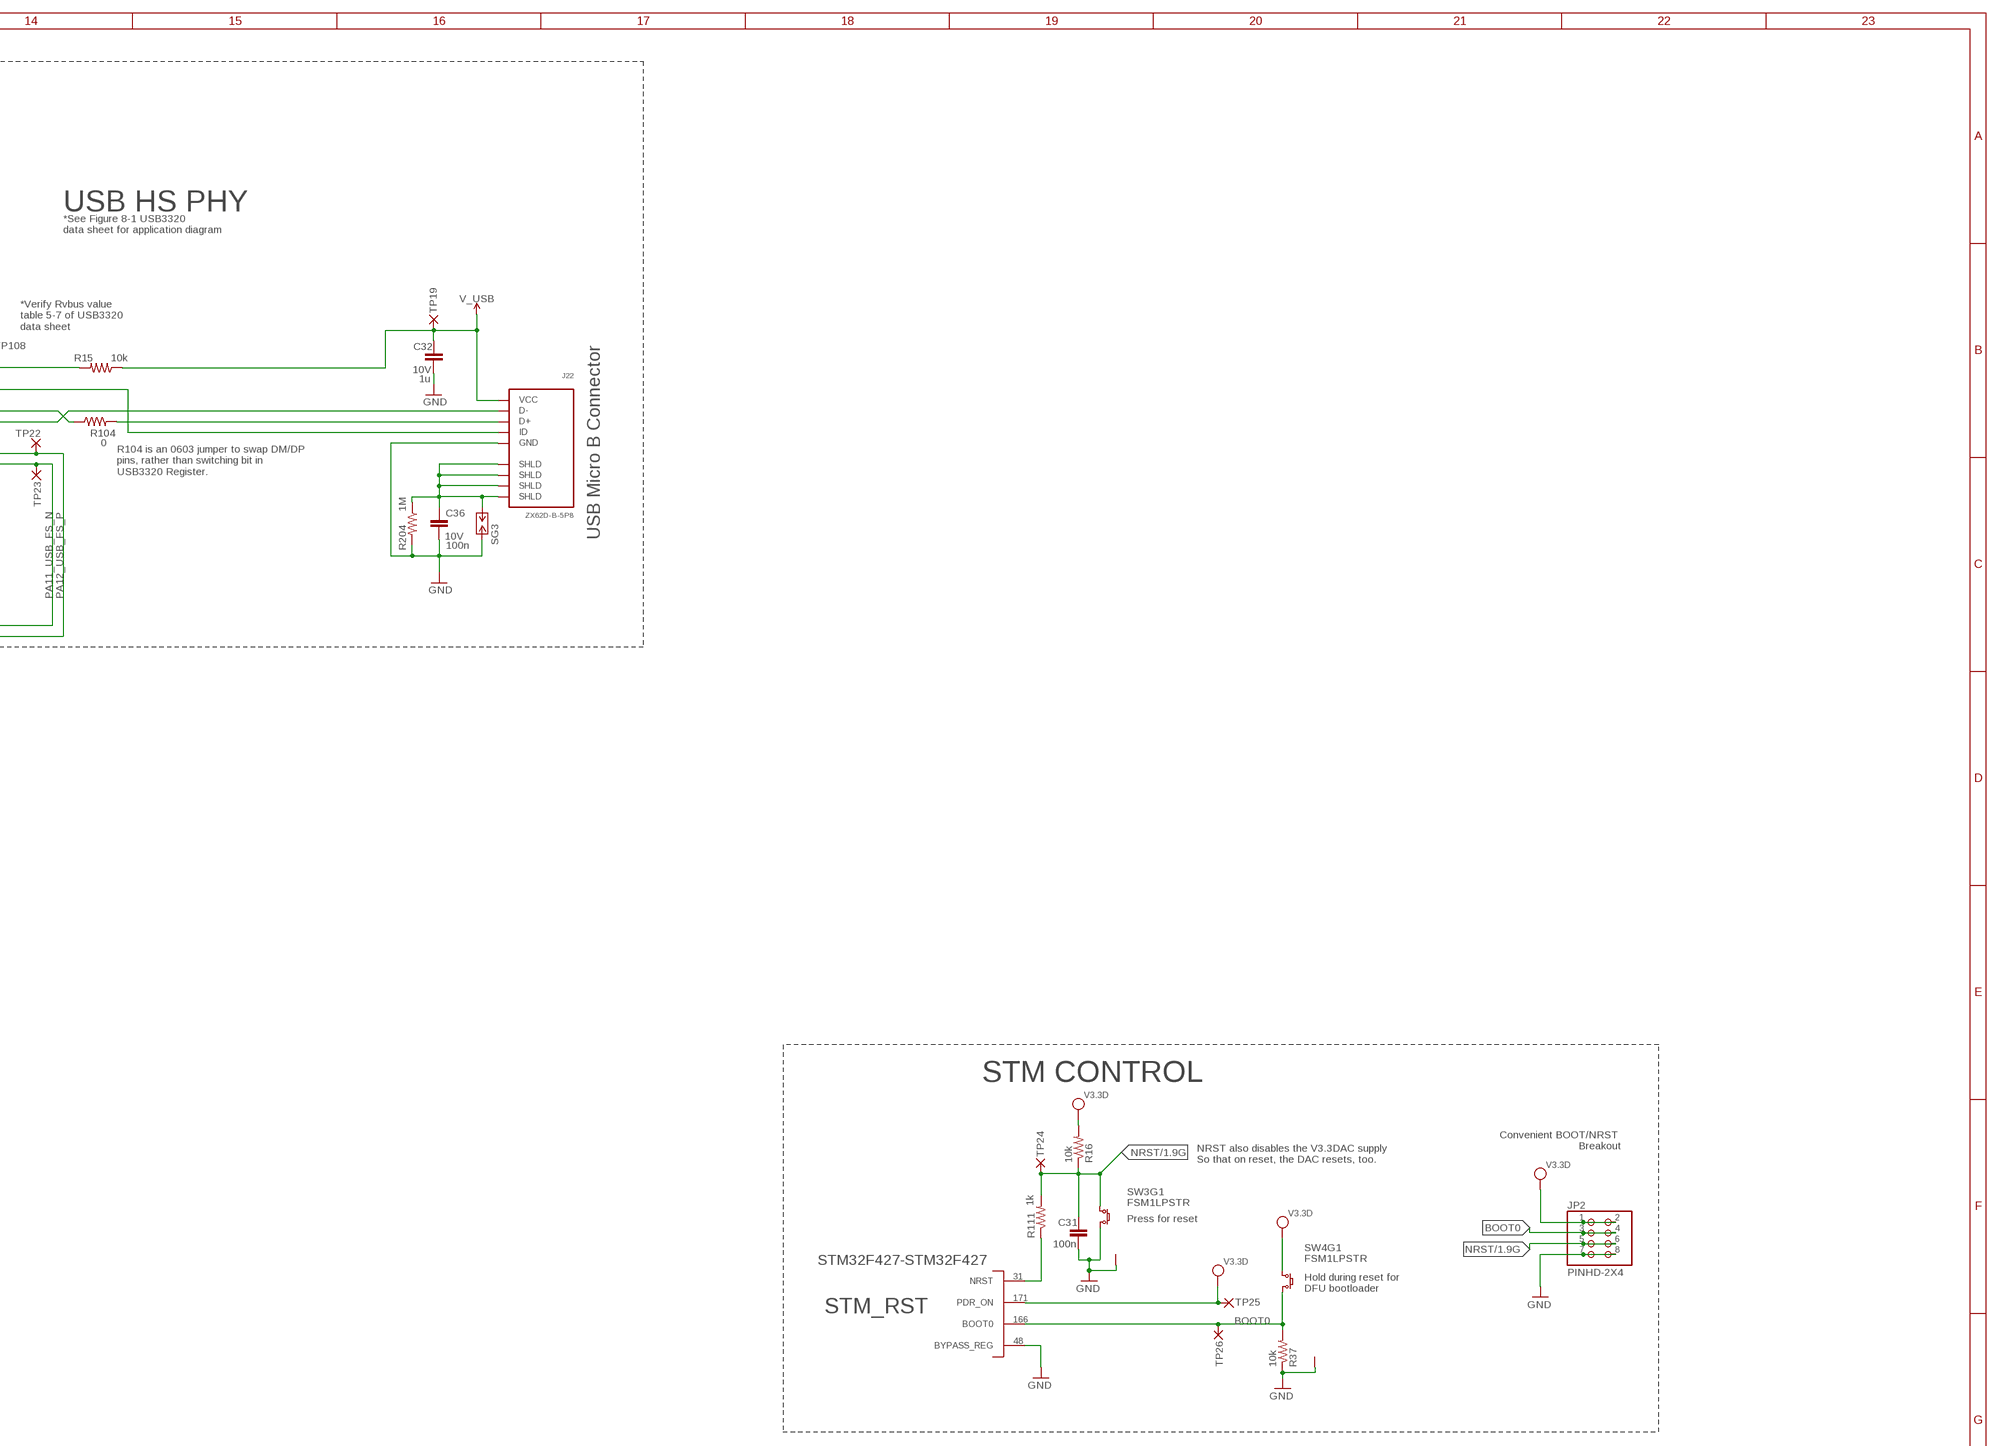
[diagram p7: schematic, sheet 2, part 5 of 6]
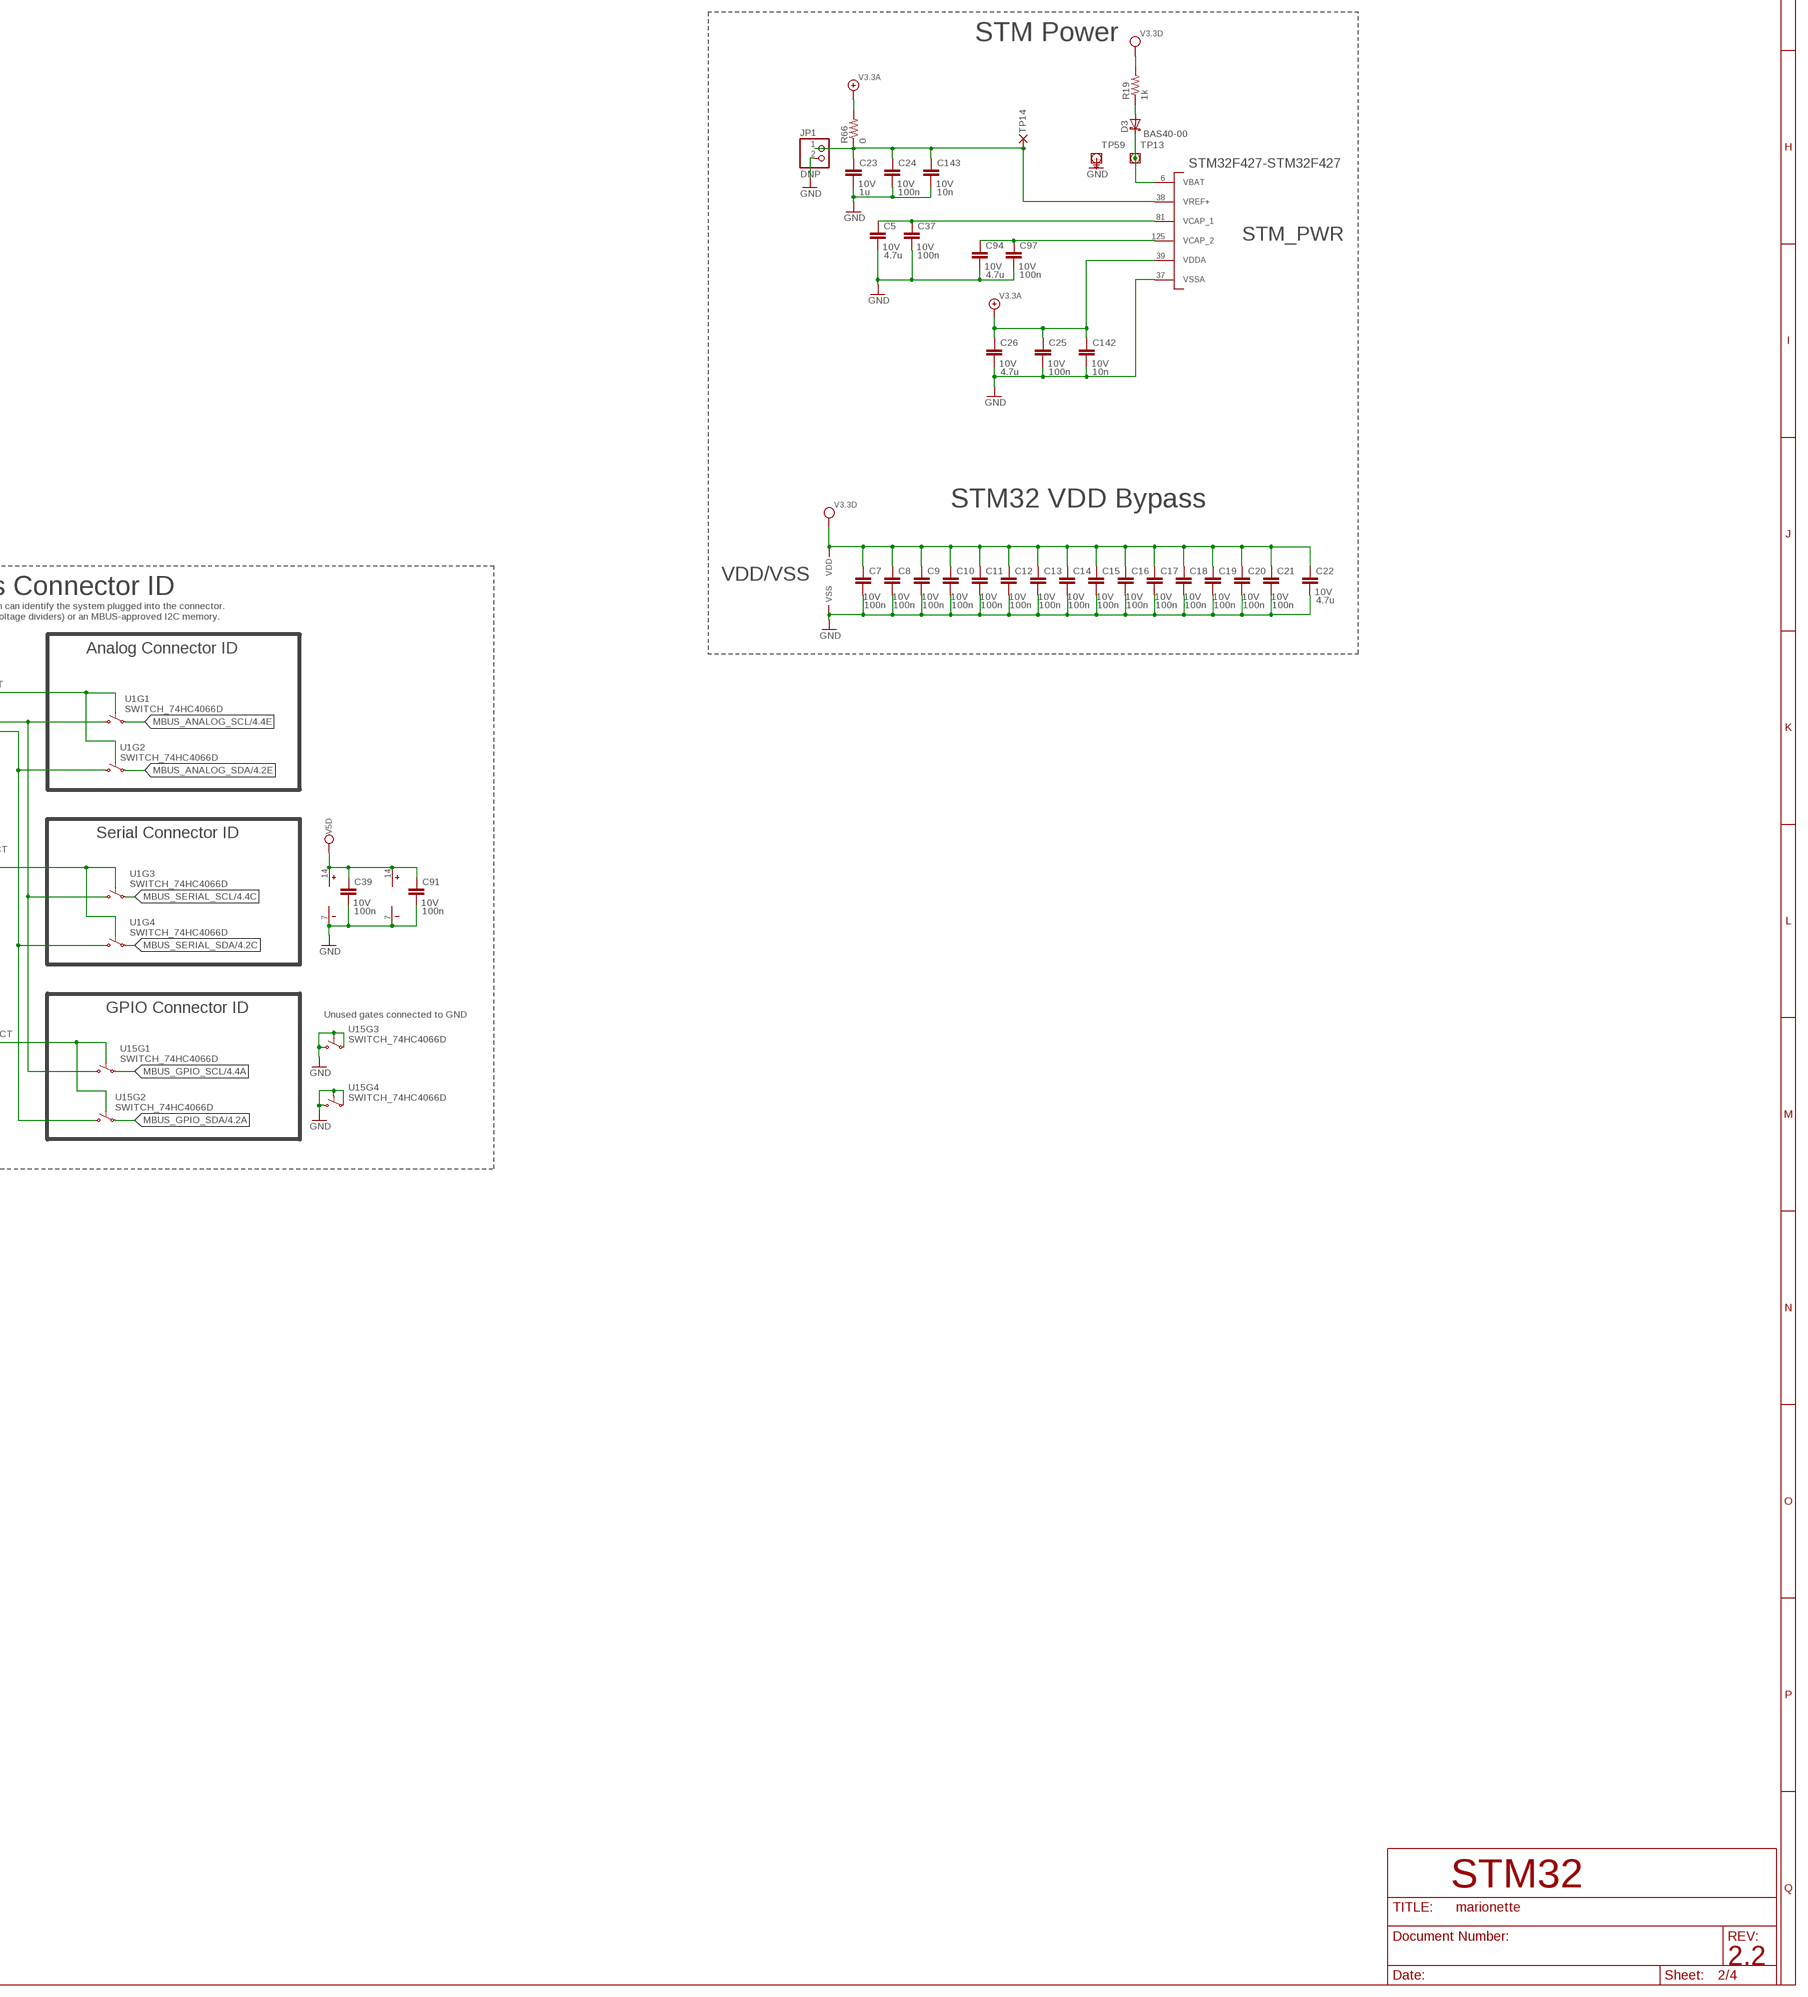
[diagram p8: schematic, sheet 2, part 6 of 6]

### Parts
C5  4.7u  C-EU0805-B  [.0805-B]
C6  10p  C-EU0402-B  [.0402-B]
C7  100n  C-EU0402-B  [.0402-B]
C8  100n  C-EU0402-B  [.0402-B]
C9  100n  C-EU0402-B  [.0402-B]
C10  100n  C-EU0402-B  [.0402-B]
C11  100n  C-EU0402-B  [.0402-B]
C12  100n  C-EU0402-B  [.0402-B]
C13  100n  C-EU0402-B  [.0402-B]
C14  100n  C-EU0402-B  [.0402-B]
C15  100n  C-EU0402-B  [.0402-B]
C16  100n  C-EU0402-B  [.0402-B]
C17  100n  C-EU0402-B  [.0402-B]
C18  100n  C-EU0402-B  [.0402-B]
C19  100n  C-EU0402-B  [.0402-B]
C20  100n  C-EU0402-B  [.0402-B]
C21  100n  C-EU0402-B  [.0402-B]
C22  4.7u  C-EU0805-B  [.0805-B]
C23  1u  C-EU0402-B  [.0402-B]
C24  100n  C-EU0402-B  [.0402-B]
C25  100n  C-EU0402-B  [.0402-B]
C26  4.7u  C-EU0805-B  [.0805-B]
C27  10p  C-EU0402-B  [.0402-B]
C28  1u  C-EU0402-B  [.0402-B]
C29  10n  C-EU0402-B  [.0402-B]
C30  10p  C-EU0402-B  [.0402-B]
C31  100n  C-EU0402-B  [.0402-B]
C32  1u  C-EU0402-B  [.0402-B]
C33  10n  C-EU0402-B  [.0402-B]
C34  DNP  C-EU0402-B  [.0402-B]
C35  DNP  C-EU0402-B  [.0402-B]
C36  100n  C-EU0402-B  [.0402-B]
C37  100n  C-EU0402-B  [.0402-B]
C39  100n  C-EU0402-B  [.0402-B]
C42  100p  C-EU0402-B  [.0402-B]
C43  100n  C-EU0402-B  [.0402-B]
C44  100n  C-EU0402-B  [.0402-B]
C47  100n  C-EU0402-B  [.0402-B]
C85  1u  C-EU0402-B  [.0402-B]
C86  100n  C-EU0402-B  [.0402-B]
C90  100n  C-EU0402-B  [.0402-B]
C91  100n  C-EU0402-B  [.0402-B]
C93  1u  C-EU0402-B  [.0402-B]
C94  4.7u  C-EU0805-B  [.0805-B]
C96  4.7u  C-EU0805-B  [.0805-B]
C97  100n  C-EU0402-B  [.0402-B]
C98  100n  C-EU0402-B  [.0402-B]
C142  10n  C-EU0402-B  [.0402-B]
C143  10n  C-EU0402-B  [.0402-B]
C146  4.7u  C-EU0805-B  [.0805-B]
C151  100n  C-EU0402-B  [.0402-B]
C152  100n  C-EU0402-B  [.0402-B]
C153  4.7u  C-EU0805-B  [.0805-B]
D3  BAS40-00  DIODE_SCHOTTKY--BAS40-00_SOT23-3  [SOT23-3]
J2  PINHD-1X3  [1X03]
J13  CONN_HEADER_JTAG  [CONN_HEADER_JTAG_SMD_10PIN_50MIL]
J14  CON_HIROSE_DM3D(MICROSD)  [HIROSE_DM3D(MICRO-SD)]
J22  ZX62D-B-5P8  [ZX62D-B-5P8]
JP1  DNP  PINHD-1X2  [1X02]
JP2  PINHD-2X4  [2X04]
LED5  SMLV56RGB1W1  LED-RGB-SEPARATE-3528  [LED-3528]
Q3  AO3419  PFET-AO3419  [SOT23-3]
R5  47k  R-US_0402-B  [.0402-B]
R6  4.7k  R-US_0402-B  [.0402-B]
R7  4.7k  R-US_0402-B  [.0402-B]
R8  47k  R-US_0402-B  [.0402-B]
R9  47k  R-US_0402-B  [.0402-B]
R10  47k  R-US_0402-B  [.0402-B]
R11  47k  R-US_0402-B  [.0402-B]
R12  620  R-US_0402-B  [.0402-B]
R13  510  R-US_0402-B  [.0402-B]
R14  510  R-US_0402-B  [.0402-B]
R15  10k  R-US_0402-B  [.0402-B]
R16  10k  R-US_0402-B  [.0402-B]
R17  0  R-US_0402-B  [.0402-B]
R18  100k  R-US_0402-B  [.0402-B]
R19  1k  R-US_0402-B  [.0402-B]
R20  10k  R-US_0402-B  [.0402-B]
R29  120  R-US_0402-B  [.0402-B]
R30  0  R-US_0402-B  [.0402-B]
R37  10k  R-US_0402-B  [.0402-B]
R63  10k  R-US_0402-B  [.0402-B]
R64  10k  R-US_0402-B  [.0402-B]
R65  100k  R-US_0402-B  [.0402-B]
R66  0  R-US_0402-B  [.0402-B]
R67  47k  R-US_0402-B  [.0402-B]
R77  10k  R-US_0402-B  [.0402-B]
R78  47k  R-US_0402-B  [.0402-B]
R104  0  R-US_0603-B  [.0603-B]
R105  1k  R-US_0402-B  [.0402-B]
R108  100k  R-US_0402-B  [.0402-B]
R111  1k  R-US_0402-B  [.0402-B]
R201  8.06k  R-US_0402-B  [.0402-B]
R202  4.7k  R-US_0402-B  [.0402-B]
R203  4.7k  R-US_0402-B  [.0402-B]
R204  1M  R-US_0402-B  [.0402-B]
SB1  TRACE_BRIDGE_6MIL  [TRACE_BRIDGE_6MIL]
SB2  TRACE_BRIDGE_6MIL  [TRACE_BRIDGE_6MIL]
SB3  TRACE_BRIDGE_6MIL  [TRACE_BRIDGE_6MIL]
SG3  SPARKGAP-5  [SPARKGAP_5MIL]
SW3  FSM1LPSTR  SWITCH_SPST_NO_GNDED  [SWITCH_TAC_NO_GNDED]
SW4  FSM1LPSTR  SWITCH_SPST_NO_GNDED  [SWITCH_TAC_NO_GNDED]
TCXO1  TCXO_D32G-026.0M  [CRYSTAL-3.2X2.5(4_TERMINAL)]
TP13  PAD+VIA_0.6MM  [PAD+VIA_0.6MM]
TP14  PAD+X-0.7-NO_CREAM+SILK  [PAD-ROUND-0.7-NOCREAM+SILK]
TP15  PAD+X-0.7-NO_CREAM+SILK  [PAD-ROUND-0.7-NOCREAM+SILK]
TP19  PAD+X-0.7-NO_CREAM+SILK  [PAD-ROUND-0.7-NOCREAM+SILK]
TP20  PAD+X-0.7-NO_CREAM+SILK  [PAD-ROUND-0.7-NOCREAM+SILK]
TP21  PAD+X-0.7-NO_CREAM+SILK  [PAD-ROUND-0.7-NOCREAM+SILK]
TP22  PAD+X-0.7-NO_CREAM+SILK  [PAD-ROUND-0.7-NOCREAM+SILK]
TP23  PAD+X-0.7-NO_CREAM+SILK  [PAD-ROUND-0.7-NOCREAM+SILK]
TP24  PAD+X-0.7-NO_CREAM+SILK  [PAD-ROUND-0.7-NOCREAM+SILK]
TP25  PAD+X-0.7-NO_CREAM+SILK  [PAD-ROUND-0.7-NOCREAM+SILK]
TP26  PAD+X-0.7-NO_CREAM+SILK  [PAD-ROUND-0.7-NOCREAM+SILK]
TP27  PAD+X-0.7-NO_CREAM+SILK  [PAD-ROUND-0.7-NOCREAM+SILK]
TP28  PAD+X-0.7-NO_CREAM+SILK  [PAD-ROUND-0.7-NOCREAM+SILK]
TP30  PAD+X-0.7-NO_CREAM+SILK  [PAD-ROUND-0.7-NOCREAM+SILK]
TP37  PAD+X-0.7-NO_CREAM+SILK  [PAD-ROUND-0.7-NOCREAM+SILK]
TP38  PAD+X-0.7-NO_CREAM+SILK  [PAD-ROUND-0.7-NOCREAM+SILK]
TP46  PAD+X-0.7-NO_CREAM+SILK  [PAD-ROUND-0.7-NOCREAM+SILK]
TP47  PAD+X-0.7-NO_CREAM+SILK  [PAD-ROUND-0.7-NOCREAM+SILK]
TP52  PAD+VIA_0.6MM  [PAD+VIA_0.6MM]
TP53  PAD+VIA_0.6MM  [PAD+VIA_0.6MM]
TP59  PAD+VIA_GND_0.6MM  [PAD+GND_VIA_0.6MM]
TP72  PAD+X-0.7-NO_CREAM+SILK  [PAD-ROUND-0.7-NOCREAM+SILK]
TP108  PAD+X-0.7-NO_CREAM+SILK  [PAD-ROUND-0.7-NOCREAM+SILK]
TP109  PAD+X-0.7-NO_CREAM+SILK  [PAD-ROUND-0.7-NOCREAM+SILK]
TP300  PAD+VIA_0.25MM  [PAD+VIA_0.25MM]
TP301  PAD+VIA_0.25MM  [PAD+VIA_0.25MM]
U1  SWITCH_74HC4066D  [SO14]
U5  MAX3051ESAESA+  [SO8]
U11  STM32F427-STM32F427  [LQFP176]
U14  USB3320  USB_PHY-SMSC-USB3320-QFN32-5X5  [QFN32-5X5]
U15  SWITCH_74HC4066D  [SO14]
X1  ABSO7  [2-SMD_ABM7]
XTAL1  DNP  XTAL_SHIELDED_403C11A26M00000  [CRYSTAL-3.2X2.5(4_TERMINAL)]

### Nets
!ULPI_RST_B: R63.1 TP20.PAD(P) U11.162(PB4) U14.27(!RST_B)
ADC2_CH2_FLT: U11.42(PA2) ; also sheet 3
ADC2_CH6_FLT: U11.52(PA6) ; also sheet 3
ADC2_CH7_FLT: U11.53(PA7) ; also sheet 3
ADC2_CH11_FLT: U11.33(PC1) ; also sheet 3
ADC2_CH13_FLT: U11.35(PC3) ; also sheet 3
ADC2_CH14_FLT: U11.54(PC4) ; also sheet 3
ADC2_CH15_FLT: U11.55(PC5) ; also sheet 3
ADC3_CH5_FLT: U11.25(PF7) ; also sheet 3
ADC3_CH6_FLT: U11.26(PF8) ; also sheet 3
ADC3_CH7_FLT: U11.27(PF9) ; also sheet 3
ADC3_CH8_FLT: U11.28(PF10) ; also sheet 3
ADC3_CH9_FLT: U11.19(PF3) ; also sheet 3
ADC3_CH14_FLT: U11.20(PF4) ; also sheet 3
ADC3_CH15_FLT: U11.21(PF5) ; also sheet 3
BOOT0: JP2.3 JP2.4 R37.2 SW4.1 SW4.2(P1) TP26.PAD(P) U11.166(CTRL:BOOT0)
BOOT1: R64.2 TP300.TP U11.58(PB2)
CAN1-H: R29.2 U5.7(CANH) ; also sheet 4
CAN1-L: R29.1 U5.6(CANL) ; also sheet 4
CAN_RS: R30.2 U5.8(RS)
DM: J22.P2(D-) U14.19(DM/DP)
DP: J22.P3(D+) R104.2
DP_1: R104.1 U14.18(DP/DM)
GND: C5.2 C6.1 C7.2 C8.2 C9.2 C10.2 C11.2 C12.2 C13.2 C14.2 C15.2 C16.2 C17.2 C18.2 C19.2 C20.2 C21.2 C22.2 C23.2 C24.2 C25.2 C26.2 C27.2 C28.2 C29.2 C30.1 C31.2 C32.2 C33.2 C34.2 C35.2 C36.2 C37.2 C39.2 C43.2 C44.1 C47.2 C85.2 C86.2 C91.2 C93.2 C94.2 C96.2 C97.2 C142.2 C143.2 C146.2 C151.2 C152.2 C153.2 J2.3 J13.3 J13.5 J13.9 J14.G1(_SHIELD1:PAD) J14.G2(_SHIELD2:PAD) J14.G3(_SHIELD3:PAD) J14.G4(_SHIELD4:PAD) J14.P6 J14.S1 J22.P5(GND) JP1.2 JP2.7 JP2.8 R18.1 R30.1 R37.1 R63.2 R64.1 R67.1 R108.2 R201.2 R204.2 SB1.1 SG3.2 SW3.3(P2) SW3.4(P2) SW3.5(SHIELD_PIN) SW4.5(SHIELD_PIN) TCXO1.2(GND) TP59.TP U1.7(V-) U5.2(GND) U11.14(PWF_MAIN:VSS) U11.22(PWF_MAIN:VSS) U11.37(PWR_REF:VSSA) U11.48(CTRL:BYPASS_REG) U11.61(PWF_MAIN:VSS) U11.71(PWF_MAIN:VSS) U11.90(PWF_MAIN:VSS) U11.102(PWF_MAIN:VSS) U11.113(PWF_MAIN:VSS) U11.126(PWF_MAIN:VSS) U11.135(PWF_MAIN:VSS) U11.148(PWF_MAIN:VSS) U11.158(PWF_MAIN:VSS) U14.PAD(GND) U15.6(EN) U15.7(V-) U15.8(Y) U15.9(Z) U15.10(Z) U15.11(Y) U15.12(EN) XTAL1.2(XTAL_GND:GND) XTAL1.4(XTAL_GND:GND) ; also sheet 1,3,4
LED_STATUS_B_CATH: LED5.6(B:K) R14.2
LED_STATUS_G_CATH: LED5.4(G:K) R13.2
LED_STATUS_R_CATH: LED5.5(R:K) R12.2
MBUS_ANALOG_SCL: U1.2(Z) ; also sheet 4
MBUS_ANALOG_SDA: U1.3(Z) ; also sheet 4
MBUS_GPIO_SCL: U15.2(Z) ; also sheet 4
MBUS_GPIO_SDA: U15.3(Z) ; also sheet 4
MBUS_SERIAL_SCL: U1.9(Z) ; also sheet 4
MBUS_SERIAL_SDA: U1.10(Z) ; also sheet 4
MCO1: C98.1 TP301.TP U11.119(PA8)
NRST: C31.1 J13.10 JP2.5 JP2.6 R16.1 R111.2 SW3.1 SW3.2(P1) TP24.PAD(P) ; also sheet 1
NRST_FILTERED: R111.1 U11.31(CTRL:NRST)
OSC32_IN: C27.1 TP38.PAD(P) U11.9(PC14) X1.P$1
OSC32_OUT: C30.2 TP37.PAD(P) U11.10(PC15) X1.P$2
OSC_IN: C35.1 C90.1 R18.2 U11.29(PH0) XTAL1.3
OSC_OUT: C34.1 TP30.PAD(P) U11.30(PH1) XTAL1.1
PA0_UART4_TX: U11.40(PA0) ; also sheet 4
PA1_UART4_RX: U11.41(PA1) ; also sheet 4
PA10_SDIO_PWR: R20.2 U11.121(PA10)
PA11_USB_FS_N [dt_line]: TP23.PAD(P) U11.122(PA11) U14.15(SPK_L)
PA12_USB_FS_P [dt_line]: TP22.PAD(P) U11.123(PA12) U14.16(SPK_R)
PA15_TIM2_CH1_ETR: U11.138(PA15) ; also sheet 4
PB6_I2C1_SCL: R6.1 TP52.TP U1.1(Y) U1.8(Y) U11.164(PB6) U15.1(Y)
PB7_I2C1_SDA: R7.1 TP53.TP U1.4(Y) U1.11(Y) U11.165(PB7) U15.4(Y)
PB8_TIM4_CH3: U11.167(PB8) ; also sheet 4
PB9_TIM4_CH4: U11.168(PB9) ; also sheet 4
PB14: U11.94(PB14) ; also sheet 4
PB15: U11.95(PB15) ; also sheet 4
PC6_DEBUG_USART6_TX: J2.1 U11.115(PC6)
PC7_DEBUG_USART6_RX: J2.2 U11.116(PC7)
PC8_SDIO_D0: J14.P7 R8.1 TP28.PAD(P) U11.117(PC8)
PC9_SDIO_D1: J14.P8 R11.1 U11.118(PC9)
PC10_SDIO_D2: J14.P1 R78.1 U11.139(PC10)
PC11_SDIO_D3: J14.P2 R10.1 U11.140(PC11)
PC12_SDIO_CK: J14.P5 U11.141(PC12)
PC13: U11.8(PC13) ; also sheet 4
PD0: U11.142(PD0) ; also sheet 4
PD1: U11.143(PD1) ; also sheet 4
PD2_SDIO_CMD: J14.P3 R9.1 U11.144(PD2)
PD3_USART2_CTS: U11.145(PD3) ; also sheet 4
PD4_USART2_RTS: U11.146(PD4) ; also sheet 4
PD5_USART2_TX: U11.147(PD5) ; also sheet 4
PD6_USART2_RX: U11.150(PD6) ; also sheet 4
PD7: U11.151(PD7) ; also sheet 4
PD8_USART3_TX: U11.96(PD8) ; also sheet 4
PD9_USART3_RX: U11.97(PD9) ; also sheet 4
PD10_SD_DETECT: J14.S0 U11.98(PD10)
PD11_USART3_CTS: U11.99(PD11) ; also sheet 4
PD12_USART3_RTS: U11.100(PD12) ; also sheet 4
PD13_LED_STATUS_R: R12.1 U11.101(PD13)
PD14_LED_STATUS_G: R13.1 U11.104(PD14)
PD15_LED_STATUS_B: R14.1 U11.105(PD15)
PE0_TIM4_ETR: U11.169(PE0) ; also sheet 4
PE1: U11.170(PE1) ; also sheet 4
PE2: U11.1(PE2) ; also sheet 4
PE3: U11.2(PE3) ; also sheet 4
PE4: U11.3(PE4)
PE5_TIM9_CH1: U11.4(PE5) ; also sheet 4
PE6_TIM9_CH2: U11.5(PE6) ; also sheet 4
PE7_TIM1_ETR: U11.68(PE7) ; also sheet 4
PE8: U11.69(PE8) ; also sheet 4
PE9_TIM1_CH1: U11.70(PE9) ; also sheet 4
PE10: U11.73(PE10)
PE11_DAC_SPI4_NSS: U11.74(PE11) ; also sheet 3
PE12_DAC_SPI4_SCK: U11.75(PE12) ; also sheet 3
PE13_TIM1_CH3: U11.76(PE13) ; also sheet 4
PE14_DAC_SPI4_MOSI: U11.77(PE14) ; also sheet 3
PE15: U11.78(PE15)
PF0_I2C2_SDA: R202.1 TP47.PAD(P) U11.16(PF0) ; also sheet 4
PF1_I2C2_SCL: R203.1 TP46.PAD(P) U11.17(PF1) ; also sheet 4
PF2_CAN_SHDN: R77.1 TP72.PAD(P) U5.5(SHDN) U11.18(PF2)
PF6: U11.24(PF6)
PF11: U11.59(PF11) ; also sheet 4
PF12: U11.60(PF12) ; also sheet 4
PF13: U11.63(PF13) ; also sheet 4
PF14: U11.64(PF14) ; also sheet 4
PF15: U11.65(PF15) ; also sheet 4
PG0: U11.66(PG0) ; also sheet 4
PG1: U11.67(PG1) ; also sheet 4
PG2: U11.106(PG2) ; also sheet 4
PG3: U11.107(PG3) ; also sheet 4
PG4: U11.108(PG4) ; also sheet 4
PG5: U11.109(PG5) ; also sheet 4
PG6: U11.110(PG6) ; also sheet 4
PG7: U11.111(PG7) ; also sheet 4
PG8_SPI6_NSS: U11.112(PG8) ; also sheet 4
PG9: U11.152(PG9) ; also sheet 4
PG10: U11.153(PG10) ; also sheet 4
PG11: U11.154(PG11) ; also sheet 4
PG12_SPI6_MISO: U11.155(PG12) ; also sheet 4
PG13_SPI6_SCK: U11.156(PG13) ; also sheet 4
PG14_SPI6_MOSI: U11.157(PG14) ; also sheet 4
PG15: U11.160(PG15) ; also sheet 4
PH2: U11.43(PH2) ; also sheet 4
PH3: U11.44(PH3) ; also sheet 4
PH5: U11.46(PH5) ; also sheet 4
PH6: U11.83(PH6) ; also sheet 4
PH7_ADC3_CH4: R6.2 U11.84(PH7)
PH8_ADC3_CH8: R7.2 U11.85(PH8)
PH9: U11.86(PH9) ; also sheet 4
PH10_TIM5_CH1: U11.87(PH10) ; also sheet 4
PH11_TIM5_CH2: U11.88(PH11) ; also sheet 4
PH12_TIM5_CH3: U11.89(PH12) ; also sheet 4
PH13_CAN1_TX: U5.1(TXD) U11.128(PH13)
PH14: U11.129(PH14) ; also sheet 4
PH15: U11.130(PH15) ; also sheet 4
PI0_SPI2_NSS: U11.131(PI0) ; also sheet 4
PI1_SPI2_SCK: U11.132(PI1) ; also sheet 4
PI2_SPI2_MISO: U11.133(PI2) ; also sheet 4
PI3_SPI2_MOSI: U11.134(PI3) ; also sheet 4
PI4: U11.173(PI4) ; also sheet 4
PI5_MBUS_ANA_SELECT: U1.5(EN) U1.13(EN) U11.174(PI5)
PI6_MBUS_SER_SELECT: U1.6(EN) U1.12(EN) U11.175(PI6)
PI7_MBUS_GPIO_SELECT: U11.176(PI7) U15.5(EN) U15.13(EN)
PI8: U11.7(PI8) ; also sheet 4
PI9_CAN1_RX: U5.4(RXD) U11.11(PI9)
PI10: U11.12(PI10) ; also sheet 4
PI11: U11.13(PI11) ; also sheet 4
RBIAS: R201.1 TP21.PAD(P) U14.24(RBIAS)
REFSEL_0: SB1.2 U14.8(S0)
REFSEL_1: SB2.2 U14.11(S1)
REFSEL_2: SB3.2 U14.14(S2)
SDIO-PWR-SWITCHED: C42.1 C43.1 C96.1 C146.1 J14.P4 Q3.3(D) R108.1 TP15.PAD(P)
SDIO-PWR_GATE: C42.2 Q3.1(G) R20.1 R65.2 TP27.PAD(P)
SHLD: C36.1 J22.P$1(SHLD) J22.P$2(SHLD) J22.P$3(SHLD) J22.P$4(SHLD) R204.1 SG3.1
STM-VBAT: D3.3(CATHODE) TP13.TP U11.6(PWR_REF:VBAT)
STM-VREF+: C23.1 C24.1 C143.1 JP1.1 R66.1 TP14.PAD(P) U11.38(PWR_REF:VREF+)
STM_DAC: U11.50(PA4) ; also sheet 3
STM_VCAP_1: C5.1 C37.1 U11.81(PWR_REF:VCAP_1)
STM_VCAP_2: C94.1 C97.1 U11.125(PWR_REF:VCAP_2)
SWDCK: J13.4 U11.137(PA14)
SWDIO: J13.2 U11.124(PA13)
SWO: J13.6 U11.161(PB3)
TCXO_OUT: R17.1 TCXO1.3(OUT)
TCXO_RC: C6.2 C90.2 R17.2
ULPI_CK: U11.51(PA5) U14.1(CLK)
ULPI_D0: U11.47(PA3) U14.3(D0)
ULPI_D1: U11.56(PB0) U14.4(D1)
ULPI_D2: U11.57(PB1) U14.5(D2)
ULPI_D3: U11.79(PB10) U14.6(D3)
ULPI_D4: U11.80(PB11) U14.7(D4)
ULPI_D5: U11.92(PB12) U14.9(D5)
ULPI_D6: U11.93(PB13) U14.10(D6)
ULPI_D7: U11.163(PB5) U14.13(D7)
ULPI_DIR: U11.34(PC2) U14.31(DIR)
ULPI_NXT: U11.45(PH4) U14.2(NXT)
ULPI_STP: U11.32(PC0) U14.29(STP)
USB3320_CPEN: TP108.PAD(P) U14.17(CPEN)
USB3320_VBUS: R15.2 U14.22(VBUS)
USB3320_XIN: C98.2 R5.1 R67.2 U14.26(XI)
USB3320_XOUT: TP109.PAD(P) U14.25(XO)
USB_ID: J22.P4(ID) U14.23(ID)
V1.8A: C29.1 C85.1 R5.2 U14.28(1.8V) U14.30(1.8V) ; also sheet 1,4
V3.3A: C25.1 C26.1 C142.1 R66.2 U11.39(PWR_REF:VDDA) ; also sheet 1,3,4
V3.3D: C7.1 C8.1 C9.1 C10.1 C11.1 C12.1 C13.1 C14.1 C15.1 C16.1 C17.1 C18.1 C19.1 C20.1 C21.1 C22.1 C28.1 C33.1 C44.2 C47.1 C86.1 C93.1 C151.1 C153.1 J13.1 JP2.1 JP2.2 LED5.1(B:A) LED5.2(R:A) LED5.3(G:A) Q3.2(S) R8.2 R9.2 R10.2 R11.2 R16.2 R19.2 R65.1 R77.2 R78.2 R202.2 R203.2 SB2.1 SB3.1 SW4.3(P2) SW4.4(P2) TCXO1.4(VCC) TP25.PAD(P) U5.3(VCC) U11.15(PWF_MAIN:VDD) U11.23(PWF_MAIN:VDD) U11.36(PWF_MAIN:VDD) U11.49(PWF_MAIN:VDD) U11.62(PWF_MAIN:VDD) U11.72(PWF_MAIN:VDD) U11.82(PWF_MAIN:VDD) U11.91(PWF_MAIN:VDD) U11.103(PWF_MAIN:VDD) U11.114(PWF_MAIN:VDD) U11.127(PWF_MAIN:VDD) U11.136(PWF_MAIN:VDD) U11.149(PWF_MAIN:VDD) U11.159(PWF_MAIN:VDD) U11.171(CTRL:PDR_ON) U11.172(PWF_MAIN:VDD) U14.20(3.3V) U14.21(VBAT) U14.32(VIO) ; also sheet 1,4
V5D: C39.1 C91.1 U1.14(V+) U15.14(V+) ; also sheet 1,4
V_USB [med-isolate]: C32.1 C152.1 J22.P1(VCC) R15.1 R105.1 TP19.PAD(P) ; also sheet 1
VBAT_ANODE: D3.1(ANODE) R19.1
VBUS_FILTERED: R105.2 U11.120(PA9)
Unconnected: J13.7 J13.8

### Buses
ULPI_BUS:ULPI_D0,ULPI_D1,ULPI_D2,ULPI_D3,ULPI_D4,ULPI_D5,ULPI_D6,ULPI_D7,ULPI_CK,ULPI_STP,ULPI_DIR,ULPI_NXT
ADC_BUS:ADC1/2/3_IN2,ADC1/2_IN6,ADC1/2_IN7,ADC1/2/3_IN11,ADC1/2/3_IN13,ADC1/2_IN14,ADC1/2_IN15,ADC3_IN9,ADC3_IN14,ADC3_IN15,ADC3_IN4,ADC3_IN5,ADC3_IN6,ADC3_IN7,ADC3_IN8,ADC2_CH15_FLT,ADC3_CH9_FLT,ADC3_CH14_FLT,ADC3_CH15_FLT,ADC3_CH5_FLT,ADC3_CH6_FLT,ADC3_CH7_FLT,ADC3_CH8_FLT
SDIO_BUS:PD2_SDIO_CMD,PC12_SDIO_CK,PC11_SDIO_D3,PC10_SDIO_D2,PC9_SDIO_D1,PC8_SDIO_D0
GPIO_BUS:PA15,PB8,PB9,PB14,PB15,PC6,PC13,PD0,PD1,PD3,PD4,PD5,PD6,PD7,PD8,PD9,PD10,PD11,PD12,PE0,PE1,PE2,PE3,PE4,PE5,PE6,PE7,PE8,PE9,PE10,PE11,PE12,PE13,PE14,PE15,PF2,PF11,PF12,PF13,PF14,PF15,PG0,PG1,PG2,PG3,PG4,PG5,PG6,PG7,PG8,PH2,PH3,PH5,PH6,PH9,PH10_TIM5_CH1,PH11_TIM5_CH2,PH12_TIM5_CH3,PH14,PH15,PI4,PI8,PI10,PI11
GPIO_BUS:PA15,PB8,PB9,PB14,PB15,PC6,PD0,PD1,PD3,PD4,PD5,PD6,PD7,PD8,PD9,PD10,PD11,PD12,PE0_TIM4_ETR,PE1,PE2,PE3,PE4,PE5_TIM9_CH1,PE6_TIM9_CH2,PE7_TIM1_ETR,PE8,PE9_TIM1_CH1,PE10,PE13_TIM1_CH3,PE15,PF2,PF11,PF12,PF13,PF14,PF15,PG0,PG1,PG2,PG3,PG4,PG5,PG6,PG7,PG9,PG10,PG11,PG15,PH2,PH3,PH5,PH6,PH9,PH10,PH11,PH12,PH14,PH15,PI4,PI5,PI6,PI7,PI8,PI10,PI11
GPIO_BUS:PA15_TIM2_CH1_ETR,PB8_TIM4_CH3,PB9_TIM4_CH4,PB14,PB15,PC6,PC13,PD0,PD1,PD3_USART2_CTS,PD4_USART2_RTS,PD5_USART2_TX,PD6_USART2_RX,PD7,PD8_USART3_TX,PD9_USART3_RX,PD10,PD11_USART3_CTS,PD12_USART3_RTS,PE0,PE1,PE2,PE3,PE4,PE5,PE6,PE7,PE8,PE9,PE10,PE13,PE15,PF2,PF11,PF12,PF13,PF14,PF15,PG0,PG1,PG2,PG3,PG4,PG5,PG6,PG7,PG9,PG10,PG11,PG15,PH2,PH3,PH5,PH6,PH9,PH10,PH11,PH12,PH14,PH15,PI4,PI5,PI6,PI7,PI8,PI10,PI11
ADC_BUS:ADC2_CH2_FLT,ADC2_CH6_FLT,ADC2_CH7_FLT,ADC2_CH11_FLT,ADC2_CH13_FLT,ADC2_CH14_FLT
SPI_BUS:PI0_SPI2_NSS,PI1_SPI2_SCK,PI2_SPI2_MISO,PI3_SPI2_MOSI,PE11_DAC_SPI4_NSS,PE12_DAC_SPI4_SCK,PE14_DAC_SPI4_MOSI,PG8_SPI6_NSS,PG13_SPI6_SCK,PG12_SPI6_MISO,PG14_SPI6_MOSI

### Notes on the sheet
- USB HS PHY
- *See Figure 8-1 USB3320 
  data sheet for application diagram
- *Verify Rvbus value
  table 5-7 of USB3320
  data sheet
- SWD Interface
- R104 is an 0603 jumper to swap DM/DP 
  pins, rather than switching bit in 
  USB3320 Register.
- NC | KEY | USB Micro B Connector
- I2C for MBUS ID
- /4.5J
- DEBUG UART TX
- SD Card Interface
- STM CONTROL
- Convenient BOOT/NRST 
  Breakout
- NRST also disables the V3.3DAC supply
  So that on reset, the DAC resets, too.
- 32.768kHz CLK
- Press for reset
- Hold during reset for
  DFU bootloader
- ABS07 32.768kHz crystal has load
  capacitance of 12.5pF. The trace
  capacitance is about 1pF. Therefore
  choose parallel caps of 11pF.
- 100k Pulldown resistor ensures SD card
  will power down quickly.
- STM Power
- 2mA
- /4.5M
- /3.1G
- 26 MHz XTAL / TCXO
  (choose one/ see IMPORTANT note)
- UNUSED
- /4.5J
- IMPORTANT:
- Connor-Winfield D32G-026.0M 26MHz
  TCXO requires supply voltage of 
  (3.135V, 3.300V, 3.456V)
- STM32 VDD Bypass
- To I2C pins
- Versions of STM32F427 bootloader
  before version 9 (v9) will not boot if
  given an external clock signal
  (i.e. TCXO).  Need chips made after
  30th week of 2014 (datecode 430),
  with silicon revision 3.  See
  STM32F40x Errata sheet v6 p35
  (DM00037591.pdf).
- In the TCXO circuit option:
  Rseries is for gain control.
  Rshunt is specified in datasheet
  for proper operation of TCXO.
  Cseries is for DC blocking.
  Cpar is to low pass filter square wave.
  Also, the values of the components in
  this block are given as XTAL/TCXO
  which give a value for each populating
  option.
- Marionette Bus Connector ID
- Each 40 pin connector has two "MBUS ID" pins which can identify the system plugged into the connector. 
  MBUS ID can either be two analog levels (resistive voltage dividers) or an MBUS-approved I2C memory.
- 26.00000MHz @ 10ppm
- The 26 MHz XTAL, Connor Winfield MPN:  
  403C11A26M00000 has a load capacitance  of 10 pF.  
  The traces are relatively short, therefore use 10 pF 
  bypass caps for C34 and C35.
- Analog Connector ID
- To I2C pins
- and PH7_ADC3_CH4 via R6 (4.7k)
- Analog and Pullups for MBUS ID
- To ADC Pins / GPIO high output for 4.7k I2C resistors | and PH8_ADC3_CH8 via R7 (4.7k)
- /4.5J
- CAN Transceiver
- To use the analog mode of the MBUS ID pins:
  1 - Tri-state the I2C port pins PB6 and PB7
  2 - Choose the right MBUS port switch (PI5, PI6, PI7)
  3 - Sample the voltage on the two pins with the ADC.
- Serial Connector ID
- To use the I2C mode of the BMUS ID pins:
  1 - Set PH7 and PH8 to GPIO pins and set them high,
  turning on the pull-up resistors.
  2 - Use I2C1 to look for MBUS-approved memory ICs.
- /4.5M
- GPIO Connector ID
- *RS pulled low for HS operation
   value of RS resistor controls 
   output slope.
- Unused gates connected to GND
- Active High (high closes switch)
- UNUSED
- UNUSED
- /4.5M
- UNUSED
- /4.5J
- STM32

## Sheet 3 of 4: ADC/DAC
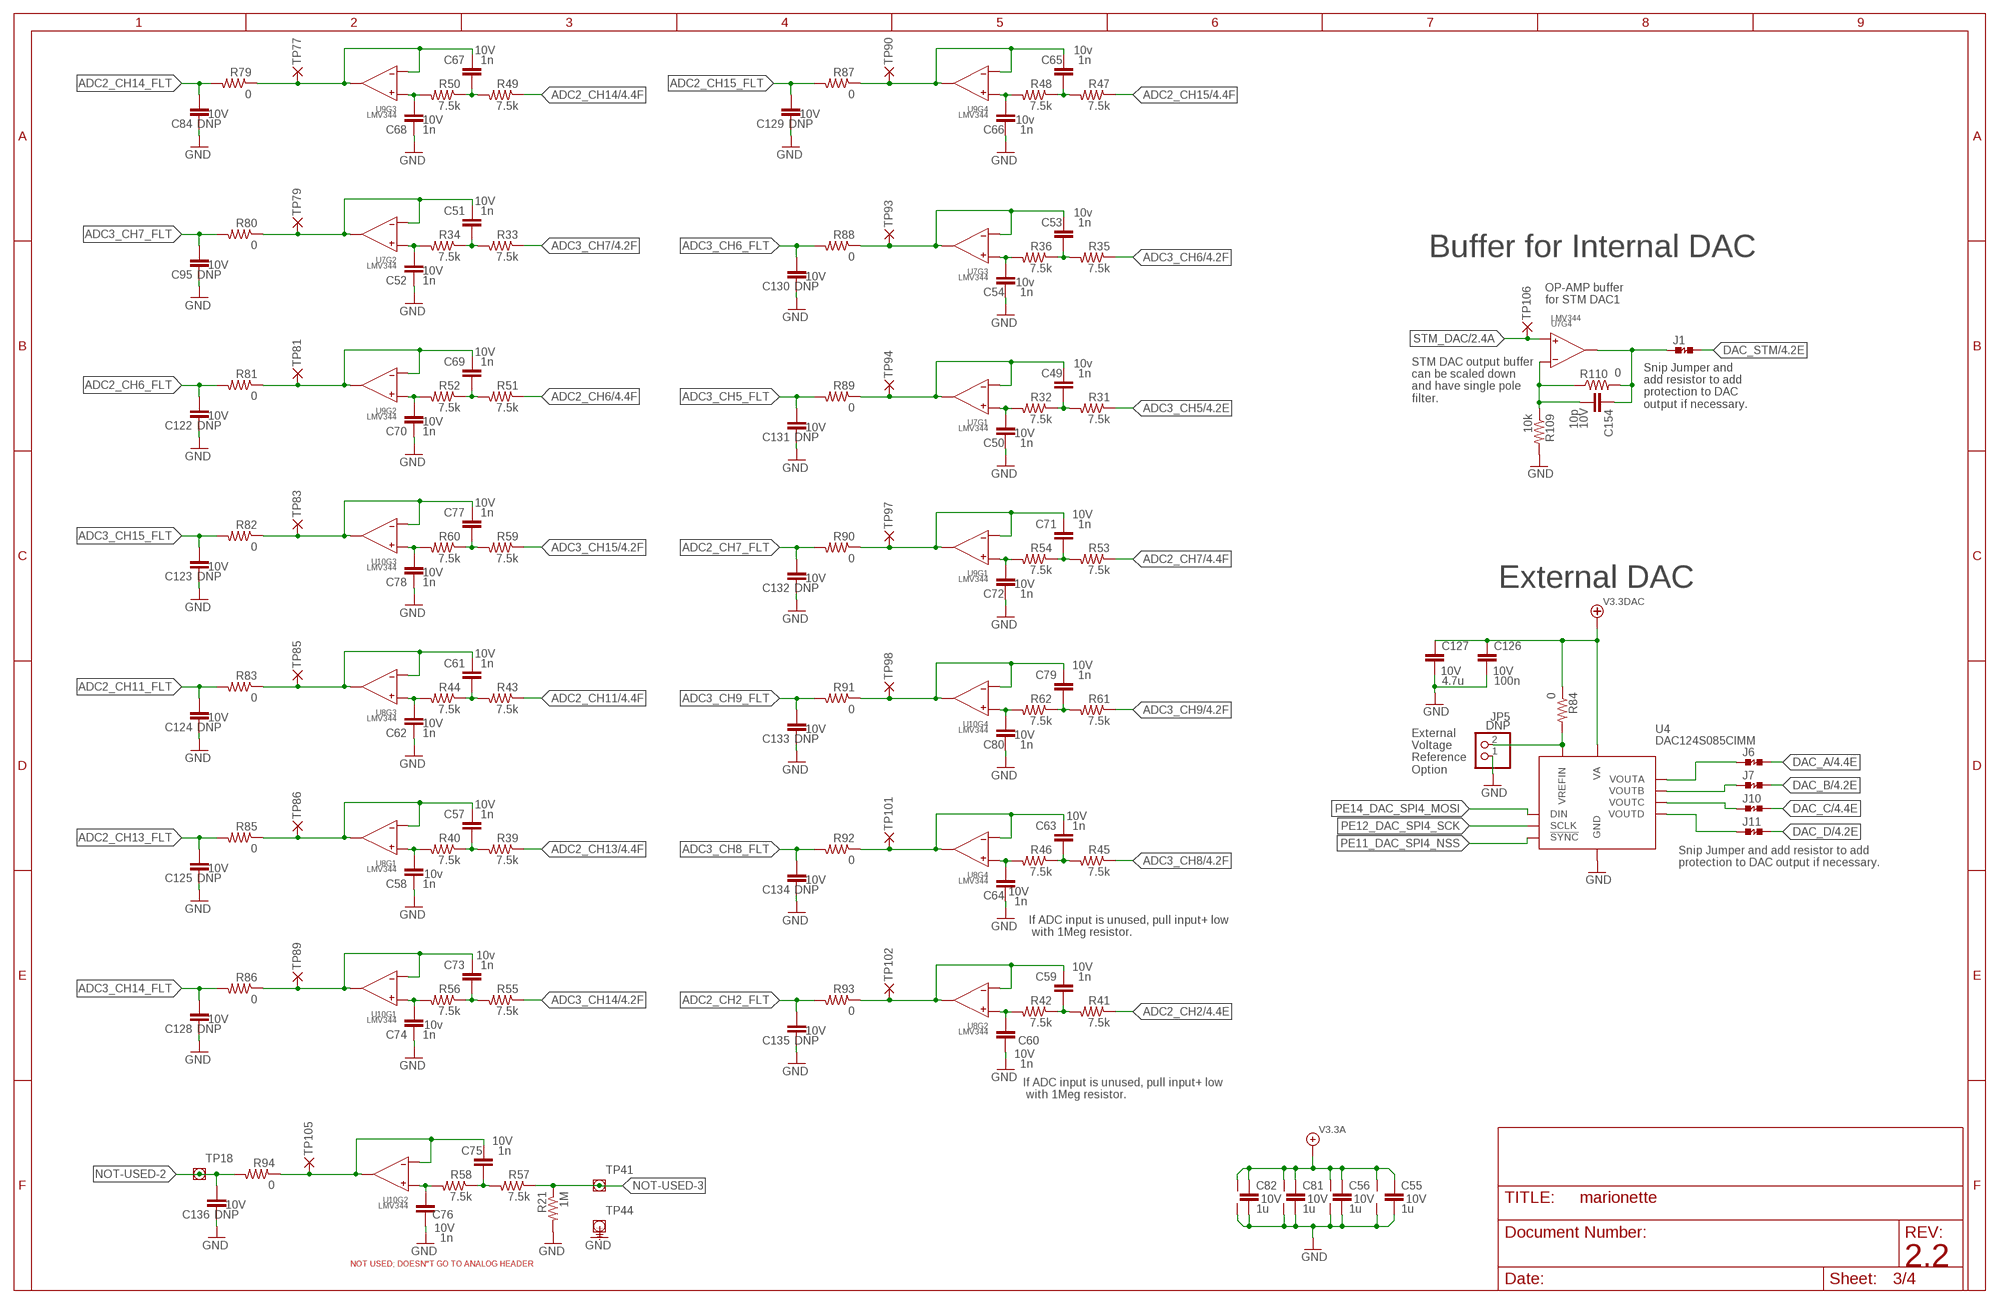
[diagram p9: schematic, sheet 3]

### Parts
C49  1n  C-EU0402-B  [.0402-B]
C50  1n  C-EU0402-B  [.0402-B]
C51  1n  C-EU0402-B  [.0402-B]
C52  1n  C-EU0402-B  [.0402-B]
C53  1n  C-EU0402-B  [.0402-B]
C54  1n  C-EU0402-B  [.0402-B]
C55  1u  C-EU0402-B  [.0402-B]
C56  1u  C-EU0402-B  [.0402-B]
C57  1n  C-EU0402-B  [.0402-B]
C58  1n  C-EU0402-B  [.0402-B]
C59  1n  C-EU0402-B  [.0402-B]
C60  1n  C-EU0402-B  [.0402-B]
C61  1n  C-EU0402-B  [.0402-B]
C62  1n  C-EU0402-B  [.0402-B]
C63  1n  C-EU0402-B  [.0402-B]
C64  1n  C-EU0402-B  [.0402-B]
C65  1n  C-EU0402-B  [.0402-B]
C66  1n  C-EU0402-B  [.0402-B]
C67  1n  C-EU0402-B  [.0402-B]
C68  1n  C-EU0402-B  [.0402-B]
C69  1n  C-EU0402-B  [.0402-B]
C70  1n  C-EU0402-B  [.0402-B]
C71  1n  C-EU0402-B  [.0402-B]
C72  1n  C-EU0402-B  [.0402-B]
C73  1n  C-EU0402-B  [.0402-B]
C74  1n  C-EU0402-B  [.0402-B]
C75  1n  C-EU0402-B  [.0402-B]
C76  1n  C-EU0402-B  [.0402-B]
C77  1n  C-EU0402-B  [.0402-B]
C78  1n  C-EU0402-B  [.0402-B]
C79  1n  C-EU0402-B  [.0402-B]
C80  1n  C-EU0402-B  [.0402-B]
C81  1u  C-EU0402-B  [.0402-B]
C82  1u  C-EU0402-B  [.0402-B]
C84  DNP  C-EU0402-B  [.0402-B]
C95  DNP  C-EU0402-B  [.0402-B]
C122  DNP  C-EU0402-B  [.0402-B]
C123  DNP  C-EU0402-B  [.0402-B]
C124  DNP  C-EU0402-B  [.0402-B]
C125  DNP  C-EU0402-B  [.0402-B]
C126  100n  C-EU0402-B  [.0402-B]
C127  4.7u  C-EU0805-B  [.0805-B]
C128  DNP  C-EU0402-B  [.0402-B]
C129  DNP  C-EU0402-B  [.0402-B]
C130  DNP  C-EU0402-B  [.0402-B]
C131  DNP  C-EU0402-B  [.0402-B]
C132  DNP  C-EU0402-B  [.0402-B]
C133  DNP  C-EU0402-B  [.0402-B]
C134  DNP  C-EU0402-B  [.0402-B]
C135  DNP  C-EU0402-B  [.0402-B]
C136  DNP  C-EU0402-B  [.0402-B]
C154  10p  C-EU0402-B  [.0402-B]
J1  JUMPER-SHORTED-CUTTABLE-E0402-0.3MM  [JUMPER-SHORTED-CUTTABLE-E0402-0.3MM]
J6  JUMPER-SHORTED-CUTTABLE-E0402-0.3MM  [JUMPER-SHORTED-CUTTABLE-E0402-0.3MM]
J7  JUMPER-SHORTED-CUTTABLE-E0402-0.3MM  [JUMPER-SHORTED-CUTTABLE-E0402-0.3MM]
J10  JUMPER-SHORTED-CUTTABLE-E0402-0.3MM  [JUMPER-SHORTED-CUTTABLE-E0402-0.3MM]
J11  JUMPER-SHORTED-CUTTABLE-E0402-0.3MM  [JUMPER-SHORTED-CUTTABLE-E0402-0.3MM]
JP5  DNP  PINHD-1X2  [1X02]
R21  1M  R-US_0402-B  [.0402-B]
R31  7.5k  R-US_0402-B  [.0402-B]
R32  7.5k  R-US_0402-B  [.0402-B]
R33  7.5k  R-US_0402-B  [.0402-B]
R34  7.5k  R-US_0402-B  [.0402-B]
R35  7.5k  R-US_0402-B  [.0402-B]
R36  7.5k  R-US_0402-B  [.0402-B]
R39  7.5k  R-US_0402-B  [.0402-B]
R40  7.5k  R-US_0402-B  [.0402-B]
R41  7.5k  R-US_0402-B  [.0402-B]
R42  7.5k  R-US_0402-B  [.0402-B]
R43  7.5k  R-US_0402-B  [.0402-B]
R44  7.5k  R-US_0402-B  [.0402-B]
R45  7.5k  R-US_0402-B  [.0402-B]
R46  7.5k  R-US_0402-B  [.0402-B]
R47  7.5k  R-US_0402-B  [.0402-B]
R48  7.5k  R-US_0402-B  [.0402-B]
R49  7.5k  R-US_0402-B  [.0402-B]
R50  7.5k  R-US_0402-B  [.0402-B]
R51  7.5k  R-US_0402-B  [.0402-B]
R52  7.5k  R-US_0402-B  [.0402-B]
R53  7.5k  R-US_0402-B  [.0402-B]
R54  7.5k  R-US_0402-B  [.0402-B]
R55  7.5k  R-US_0402-B  [.0402-B]
R56  7.5k  R-US_0402-B  [.0402-B]
R57  7.5k  R-US_0402-B  [.0402-B]
R58  7.5k  R-US_0402-B  [.0402-B]
R59  7.5k  R-US_0402-B  [.0402-B]
R60  7.5k  R-US_0402-B  [.0402-B]
R61  7.5k  R-US_0402-B  [.0402-B]
R62  7.5k  R-US_0402-B  [.0402-B]
R79  0  R-US_0402-B  [.0402-B]
R80  0  R-US_0402-B  [.0402-B]
R81  0  R-US_0402-B  [.0402-B]
R82  0  R-US_0402-B  [.0402-B]
R83  0  R-US_0402-B  [.0402-B]
R84  0  R-US_0402-B  [.0402-B]
R85  0  R-US_0402-B  [.0402-B]
R86  0  R-US_0402-B  [.0402-B]
R87  0  R-US_0402-B  [.0402-B]
R88  0  R-US_0402-B  [.0402-B]
R89  0  R-US_0402-B  [.0402-B]
R90  0  R-US_0402-B  [.0402-B]
R91  0  R-US_0402-B  [.0402-B]
R92  0  R-US_0402-B  [.0402-B]
R93  0  R-US_0402-B  [.0402-B]
R94  0  R-US_0402-B  [.0402-B]
R109  10k  R-US_0402-B  [.0402-B]
R110  0  R-US_0402-B  [.0402-B]
TP18  PAD+VIA_0.6MM  [PAD+VIA_0.6MM]
TP41  PAD+VIA_0.6MM  [PAD+VIA_0.6MM]
TP44  PAD+VIA_GND_0.6MM  [PAD+GND_VIA_0.6MM]
TP77  PAD+X-0.7-NO_CREAM+SILK  [PAD-ROUND-0.7-NOCREAM+SILK]
TP79  PAD+X-0.7-NO_CREAM+SILK  [PAD-ROUND-0.7-NOCREAM+SILK]
TP81  PAD+X-0.7-NO_CREAM+SILK  [PAD-ROUND-0.7-NOCREAM+SILK]
TP83  PAD+X-0.7-NO_CREAM+SILK  [PAD-ROUND-0.7-NOCREAM+SILK]
TP85  PAD+X-0.7-NO_CREAM+SILK  [PAD-ROUND-0.7-NOCREAM+SILK]
TP86  PAD+X-0.7-NO_CREAM+SILK  [PAD-ROUND-0.7-NOCREAM+SILK]
TP89  PAD+X-0.7-NO_CREAM+SILK  [PAD-ROUND-0.7-NOCREAM+SILK]
TP90  PAD+X-0.7-NO_CREAM+SILK  [PAD-ROUND-0.7-NOCREAM+SILK]
TP93  PAD+X-0.7-NO_CREAM+SILK  [PAD-ROUND-0.7-NOCREAM+SILK]
TP94  PAD+X-0.7-NO_CREAM+SILK  [PAD-ROUND-0.7-NOCREAM+SILK]
TP97  PAD+X-0.7-NO_CREAM+SILK  [PAD-ROUND-0.7-NOCREAM+SILK]
TP98  PAD+X-0.7-NO_CREAM+SILK  [PAD-ROUND-0.7-NOCREAM+SILK]
TP101  PAD+X-0.7-NO_CREAM+SILK  [PAD-ROUND-0.7-NOCREAM+SILK]
TP102  PAD+X-0.7-NO_CREAM+SILK  [PAD-ROUND-0.7-NOCREAM+SILK]
TP105  PAD+X-0.7-NO_CREAM+SILK  [PAD-ROUND-0.7-NOCREAM+SILK]
TP106  PAD+X-0.7-NO_CREAM+SILK  [PAD-ROUND-0.7-NOCREAM+SILK]
U4  DAC124S085CIMM  DAC124S085CIMM_DAC124S085CIMM  [10-TFSOP]
U7  LMV344  [SOIC-14]
U8  LMV344  [SOIC-14]
U9  LMV344  [SOIC-14]
U10  LMV344  [SOIC-14]

### Nets
ADC1/2/3_CH2_OUT: C59.1 R93.1 TP102.PAD(P) U8.6(-V) U8.7(OUT)
ADC1/2/3_CH11_OUT: C61.1 R83.1 TP85.PAD(P) U8.8(OUT) U8.9(-V)
ADC1/2/3_CH13_OUT: C57.1 R85.1 TP86.PAD(P) U8.1(OUT) U8.2(-V)
ADC1/2/3_IN2+: C60.1 R42.2 U8.5(+V)
ADC1/2/3_IN2_FILT: C59.2 R41.2 R42.1
ADC1/2/3_IN11+: C62.1 R44.2 U8.10(+V)
ADC1/2/3_IN11_FILT: C61.2 R43.2 R44.1
ADC1/2/3_IN13+: C58.1 R40.2 U8.3(+V)
ADC1/2/3_IN13_FILT: C57.2 R39.2 R40.1
ADC1/2_CH6_OUT: C69.1 R81.1 TP81.PAD(P) U9.6(-V) U9.7(OUT)
ADC1/2_CH7_OUT: C71.1 R90.1 TP97.PAD(P) U9.1(OUT) U9.2(-V)
ADC1/2_CH14_OUT: C67.1 R79.1 TP77.PAD(P) U9.8(OUT) U9.9(-V)
ADC1/2_CH15_OUT: C65.1 R87.1 TP90.PAD(P) U9.13(-V) U9.14(OUT)
ADC1/2_IN6+: C70.1 R52.2 U9.5(+V)
ADC1/2_IN6_FILT: C69.2 R51.2 R52.1
ADC1/2_IN7+: C72.1 R54.2 U9.3(+V)
ADC1/2_IN7_FILT: C71.2 R53.2 R54.1
ADC1/2_IN14+: C68.1 R50.2 U9.10(+V)
ADC1/2_IN14_FILT: C67.2 R49.2 R50.1
ADC1/2_IN15+: C66.1 R48.2 U9.12(+V)
ADC1/2_IN15_FILT: C65.2 R47.2 R48.1
ADC2_CH2: R41.1 ; also sheet 4
ADC2_CH2_FLT: C135.1 R93.2 ; also sheet 2
ADC2_CH6: R51.1 ; also sheet 4
ADC2_CH6_FLT: C122.1 R81.2 ; also sheet 2
ADC2_CH7: R53.1 ; also sheet 4
ADC2_CH7_FLT: C132.1 R90.2 ; also sheet 2
ADC2_CH11: R43.1 ; also sheet 4
ADC2_CH11_FLT: C124.1 R83.2 ; also sheet 2
ADC2_CH13: R39.1 ; also sheet 4
ADC2_CH13_FLT: C125.1 R85.2 ; also sheet 2
ADC2_CH14: R49.1 ; also sheet 4
ADC2_CH14_FLT: C84.1 R79.2 ; also sheet 2
ADC2_CH15: R47.1 ; also sheet 4
ADC2_CH15_FLT: C129.1 R87.2 ; also sheet 2
ADC3_CH4_OUT: C75.1 R94.1 TP105.PAD(P) U10.6(-V) U10.7(OUT)
ADC3_CH5: R31.1 ; also sheet 4
ADC3_CH5_FLT: C131.1 R89.2 ; also sheet 2
ADC3_CH5_OUT: C49.1 R89.1 TP94.PAD(P) U7.1(OUT) U7.2(-V)
ADC3_CH6: R35.1 ; also sheet 4
ADC3_CH6_FLT: C130.1 R88.2 ; also sheet 2
ADC3_CH6_OUT: C53.1 R88.1 TP93.PAD(P) U7.8(OUT) U7.9(-V)
ADC3_CH7: R33.1 ; also sheet 4
ADC3_CH7_FLT: C95.1 R80.2 ; also sheet 2
ADC3_CH7_OUT: C51.1 R80.1 TP79.PAD(P) U7.6(-V) U7.7(OUT)
ADC3_CH8: R45.1 ; also sheet 4
ADC3_CH8_FLT: C134.1 R92.2 ; also sheet 2
ADC3_CH8_OUT: C63.1 R92.1 TP101.PAD(P) U8.13(-V) U8.14(OUT)
ADC3_CH9: R61.1 ; also sheet 4
ADC3_CH9_FLT: C133.1 R91.2 ; also sheet 2
ADC3_CH14: R55.1 ; also sheet 4
ADC3_CH14_FLT: C128.1 R86.2 ; also sheet 2
ADC3_CH14_OUT: C73.1 R86.1 TP89.PAD(P) U10.1(OUT) U10.2(-V)
ADC3_CH15: R59.1 ; also sheet 4
ADC3_CH15_FLT: C123.1 R82.2 ; also sheet 2
ADC3_CH15_OUT: C77.1 R82.1 TP83.PAD(P) U10.8(OUT) U10.9(-V)
ADC3_IN4+: C76.1 R58.2 U10.5(+V)
ADC3_IN4_FILT: C75.2 R57.2 R58.1
ADC3_IN5+: C50.1 R32.2 U7.3(+V)
ADC3_IN5_FILT: C49.2 R31.2 R32.1
ADC3_IN6+: C54.1 R36.2 U7.10(+V)
ADC3_IN6_FILT: C53.2 R35.2 R36.1
ADC3_IN7+: C52.1 R34.2 U7.5(+V)
ADC3_IN7_FILT: C51.2 R33.2 R34.1
ADC3_IN8+: C64.1 R46.2 U8.12(+V)
ADC3_IN8_FILT: C63.2 R45.2 R46.1
ADC3_IN9+: C80.1 R62.2 U10.12(+V)
ADC3_IN9_FILT: C79.2 R61.2 R62.1
ADC3_IN9_OUT: C79.1 R91.1 TP98.PAD(P) U10.13(-V) U10.14(OUT)
ADC3_IN14+: C74.1 R56.2 U10.3(+V)
ADC3_IN14_FILT: C73.2 R55.2 R56.1
ADC3_IN15+: C78.1 R60.2 U10.10(+V)
ADC3_IN15_FILT: C77.2 R59.2 R60.1
DAC124_VREFIN: JP5.2 R84.2 U4.7(VREFIN)
DAC_A: J6.2 ; also sheet 4
DAC_A_JUMPERED: J6.1 U4.2(VOUTA)
DAC_B: J7.2 ; also sheet 4
DAC_B_JUMPERED: J7.1 U4.3(VOUTB)
DAC_C: J10.2 ; also sheet 4
DAC_C_JUMPERED: J10.1 U4.4(VOUTC)
DAC_D: J11.2 ; also sheet 4
DAC_D_JUMPERED: J11.1 U4.5(VOUTD)
DAC_STM: J1.2 ; also sheet 4
GND: C50.2 C52.2 C54.2 C55.2 C56.2 C58.2 C60.2 C62.2 C64.2 C66.2 C68.2 C70.2 C72.2 C74.2 C76.2 C78.2 C80.2 C81.2 C82.2 C84.2 C95.2 C122.2 C123.2 C124.2 C125.2 C126.2 C127.2 C128.2 C129.2 C130.2 C131.2 C132.2 C133.2 C134.2 C135.2 C136.2 JP5.1 R21.2 R109.2 TP44.TP U4.6(GND) U7.11(GND) U8.11(GND) U9.11(GND) U10.11(GND) ; also sheet 1,2,4
NOT-USED-2: C136.1 R94.2 TP18.TP
NOT-USED-3: R21.1 R57.1 TP41.TP
PE11_DAC_SPI4_NSS: U4.9(!SYNC!) ; also sheet 2
PE12_DAC_SPI4_SCK: U4.10(SCLK) ; also sheet 2
PE14_DAC_SPI4_MOSI: U4.8(DIN) ; also sheet 2
STM_DAC: TP106.PAD(P) U7.12(+V) ; also sheet 2
STM_DAC-: C154.2 R109.1 R110.1 U7.13(-V)
STM_DAC_OUT: C154.1 J1.1 R110.2 U7.14(OUT)
V3.3A: C55.1 C56.1 C81.1 C82.1 U7.4(VCC) U8.4(VCC) U9.4(VCC) U10.4(VCC) ; also sheet 1,2,4
V3.3DAC: C126.1 C127.1 R84.1 U4.1(VA) ; also sheet 1

### Notes on the sheet
- Buffer for Internal DAC
- OP-AMP buffer
  for STM DAC1
- STM DAC output buffer
  can be scaled down 
  and have single pole
  filter.
- Snip Jumper and 
  add resistor to add
  protection to DAC 
  output if necessary.
- External DAC
- External 
  Voltage
  Reference
  Option
- Snip Jumper and add resistor to add
  protection to DAC output if necessary.
- If ADC input is unused, pull input+ low
   with 1Meg resistor.
- If ADC input is unused, pull input+ low
   with 1Meg resistor.
- NOT USED; DOESN"T GO TO ANALOG HEADER

## Sheet 4 of 4: Headers
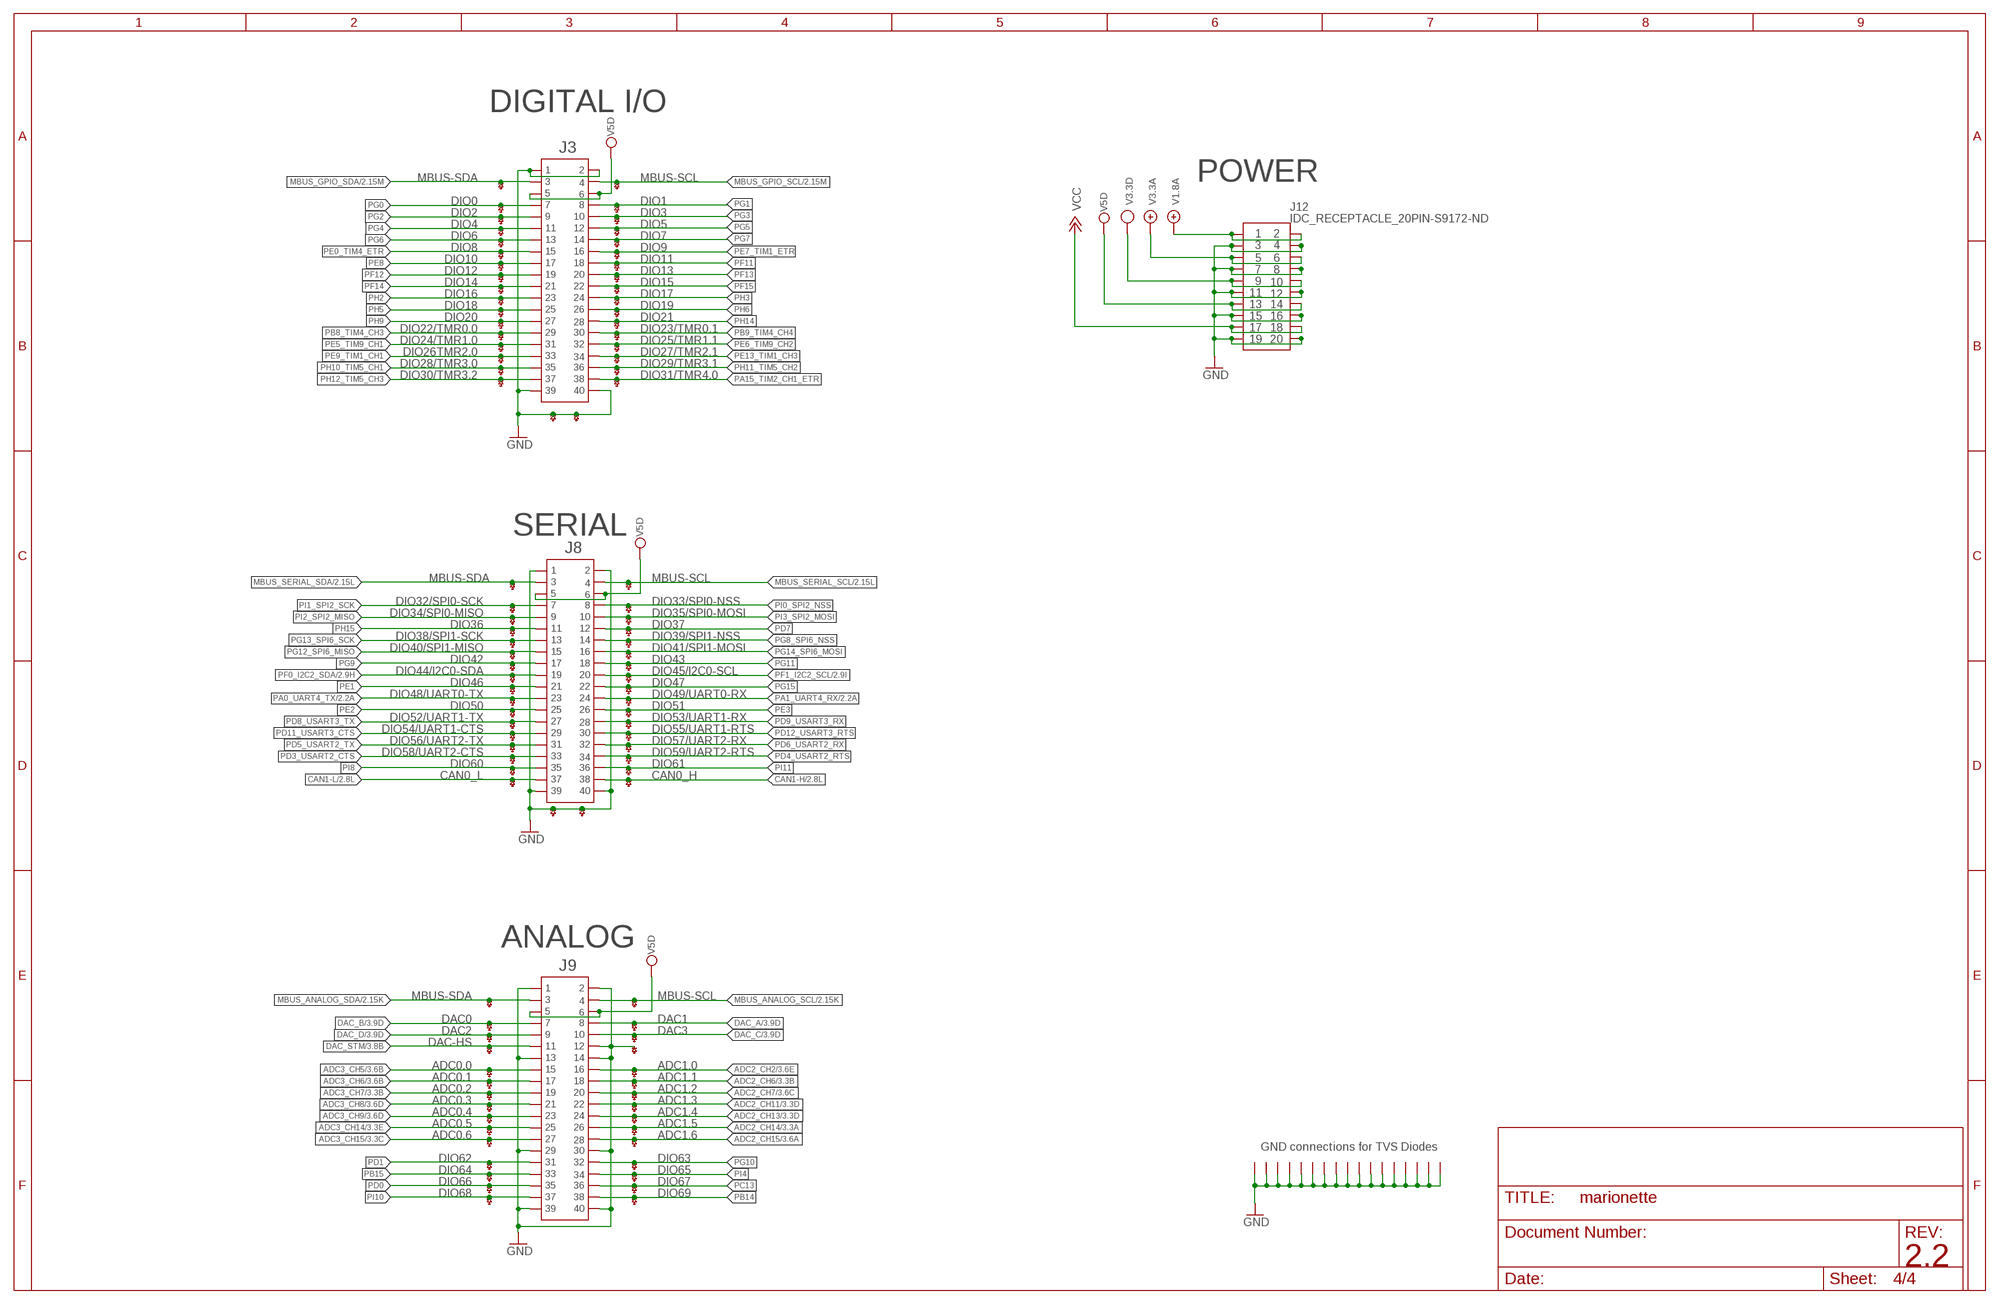
[diagram p10: schematic, sheet 4]

### Parts
D1  ESD8006-ESD8006  [UDFN-8-3.3X1.0_6MIL]
D2  ESD8006-ESD8006  [UDFN-8-3.3X1.0_6MIL]
D4  ESD8006-ESD8006  [UDFN-8-3.3X1.0_6MIL]
D5  ESD8006-ESD8006  [UDFN-8-3.3X1.0_6MIL]
D6  ESD8006-ESD8006  [UDFN-8-3.3X1.0_6MIL]
D7  ESD8006-ESD8006  [UDFN-8-3.3X1.0_6MIL]
D8  ESD8006-ESD8006  [UDFN-8-3.3X1.0_6MIL]
D9  ESD8006-ESD8006  [UDFN-8-3.3X1.0_6MIL]
D10  ESD8006-ESD8006  [UDFN-8-3.3X1.0_6MIL]
D11  ESD8006-ESD8006  [UDFN-8-3.3X1.0_6MIL]
D12  ESD8006-ESD8006  [UDFN-8-3.3X1.0_6MIL]
D13  ESD8006-ESD8006  [UDFN-8-3.3X1.0_6MIL]
D14  ESD8006-ESD8006  [UDFN-8-3.3X1.0_6MIL]
D15  ESD8006-ESD8006  [UDFN-8-3.3X1.0_6MIL]
D16  ESD8006-ESD8006  [UDFN-8-3.3X1.0_6MIL]
D17  ESD8006-ESD8006  [UDFN-8-3.3X1.0_6MIL]
D18  ESD8006-ESD8006  [UDFN-8-3.3X1.0_6MIL]
J3  IDC_RECEPTACLE_2X20-S9175-ND  [IDC_RECEPTACLES]
J8  IDC_RECEPTACLE_2X20-S9175-ND  [IDC_RECEPTACLES]
J9  IDC_RECEPTACLE_2X20-S9175-ND  [IDC_RECEPTACLES]
J12  IDC_RECEPTACLE_20PIN-S9172-ND  [IDC_RECEPTACLES_20PIN]

### Nets
ADC2_CH2: D1.5 J9.16 ; also sheet 3
ADC2_CH6: D1.2 J9.18 ; also sheet 3
ADC2_CH7: D5.7 J9.20 ; also sheet 3
ADC2_CH11: D5.4 J9.22 ; also sheet 3
ADC2_CH13: D5.2 J9.24 ; also sheet 3
ADC2_CH14: D6.7 J9.26 ; also sheet 3
ADC2_CH15: D6.4 J9.28 ; also sheet 3
ADC3_CH5: D1.4 J9.15 ; also sheet 3
ADC3_CH6: D1.1 J9.17 ; also sheet 3
ADC3_CH7: D5.8 J9.19 ; also sheet 3
ADC3_CH8: D5.5 J9.21 ; also sheet 3
ADC3_CH9: D5.1 J9.23 ; also sheet 3
ADC3_CH14: D6.8 J9.25 ; also sheet 3
ADC3_CH15: D6.5 J9.27 ; also sheet 3
CAN1-H: D12.4 J8.38 ; also sheet 2
CAN1-L: D12.5 J8.37 ; also sheet 2
DAC_A: D2.5 J9.8 ; also sheet 3
DAC_B: D2.4 J9.7 ; also sheet 3
DAC_C: D2.2 J9.10 ; also sheet 3
DAC_D: D2.1 J9.9 ; also sheet 3
DAC_STM: D1.8 J9.11 ; also sheet 3
GND: D1.3 D1.6 D1.7 D1.9 D1.10 D2.3 D2.6 D2.9 D2.10 D4.3 D4.6 D4.9 D4.10 D5.3 D5.6 D5.9 D5.10 D6.3 D6.6 D6.9 D6.10 D7.3 D7.6 D7.9 D7.10 D8.3 D8.6 D8.9 D8.10 D9.3 D9.6 D9.9 D9.10 D10.3 D10.6 D10.9 D10.10 D11.3 D11.6 D11.9 D11.10 D12.1 D12.2 D12.3 D12.6 D12.9 D12.10 D13.1 D13.2 D13.3 D13.6 D13.9 D13.10 D14.3 D14.6 D14.9 D14.10 D15.3 D15.6 D15.9 D15.10 D16.3 D16.6 D16.9 D16.10 D17.3 D17.6 D17.9 D17.10 D18.3 D18.6 D18.9 D18.10 J3.1 J3.2 J3.39 J3.40 J8.1 J8.2 J8.39 J8.40 J9.1 J9.2 J9.12 J9.13 J9.14 J9.29 J9.30 J9.39 J9.40 J12.3 J12.4 J12.7 J12.8 J12.11 J12.12 J12.15 J12.16 J12.19 J12.20 ; also sheet 1,2,3
MBUS_ANALOG_SCL: D2.7 J9.4 ; also sheet 2
MBUS_ANALOG_SDA: D2.8 J9.3 ; also sheet 2
MBUS_GPIO_SCL: D18.8 J3.4 ; also sheet 2
MBUS_GPIO_SDA: D18.7 J3.3 ; also sheet 2
MBUS_SERIAL_SCL: D4.7 J8.4 ; also sheet 2
MBUS_SERIAL_SDA: D4.8 J8.3 ; also sheet 2
PA0_UART4_TX: D9.8 J8.23 ; also sheet 2
PA1_UART4_RX: D9.7 J8.24 ; also sheet 2
PA15_TIM2_CH1_ETR: D13.4 J3.38 ; also sheet 2
PB8_TIM4_CH3: D14.8 J3.29 ; also sheet 2
PB9_TIM4_CH4: D14.7 J3.30 ; also sheet 2
PB14: D7.2 J9.38 ; also sheet 2
PB15: D7.8 J9.33 ; also sheet 2
PC13: D7.4 J9.36 ; also sheet 2
PD0: D7.5 J9.35 ; also sheet 2
PD1: D6.1 J9.31 ; also sheet 2
PD3_USART2_CTS: D11.1 J8.33 ; also sheet 2
PD4_USART2_RTS: D11.2 J8.34 ; also sheet 2
PD5_USART2_TX: D11.5 J8.31 ; also sheet 2
PD6_USART2_RX: D11.4 J8.32 ; also sheet 2
PD7: D8.7 J8.12 ; also sheet 2
PD8_USART3_TX: D9.1 J8.27 ; also sheet 2
PD9_USART3_RX: D9.2 J8.28 ; also sheet 2
PD11_USART3_CTS: D11.8 J8.29 ; also sheet 2
PD12_USART3_RTS: D11.7 J8.30 ; also sheet 2
PE0_TIM4_ETR: D17.1 J3.15 ; also sheet 2
PE1: D10.1 J8.21 ; also sheet 2
PE2: D9.5 J8.25 ; also sheet 2
PE3: D9.4 J8.26 ; also sheet 2
PE5_TIM9_CH1: D14.5 J3.31 ; also sheet 2
PE6_TIM9_CH2: D14.4 J3.32 ; also sheet 2
PE7_TIM1_ETR: D17.2 J3.16 ; also sheet 2
PE8: D16.8 J3.17 ; also sheet 2
PE9_TIM1_CH1: D14.1 J3.33 ; also sheet 2
PE13_TIM1_CH3: D14.2 J3.34 ; also sheet 2
PF0_I2C2_SDA: D10.5 J8.19 ; also sheet 2
PF1_I2C2_SCL: D10.4 J8.20 ; also sheet 2
PF11: D16.7 J3.18 ; also sheet 2
PF12: D16.5 J3.19 ; also sheet 2
PF13: D16.4 J3.20 ; also sheet 2
PF14: D16.1 J3.21 ; also sheet 2
PF15: D16.2 J3.22 ; also sheet 2
PG0: D18.5 J3.7 ; also sheet 2
PG1: D18.4 J3.8 ; also sheet 2
PG2: D18.2 J3.9 ; also sheet 2
PG3: D18.1 J3.10 ; also sheet 2
PG4: D17.8 J3.11 ; also sheet 2
PG5: D17.7 J3.12 ; also sheet 2
PG6: D17.5 J3.13 ; also sheet 2
PG7: D17.4 J3.14 ; also sheet 2
PG8_SPI6_NSS: D8.4 J8.14 ; also sheet 2
PG9: D10.8 J8.17 ; also sheet 2
PG10: D6.2 J9.32 ; also sheet 2
PG11: D10.7 J8.18 ; also sheet 2
PG12_SPI6_MISO: D8.1 J8.15 ; also sheet 2
PG13_SPI6_SCK: D8.5 J8.13 ; also sheet 2
PG14_SPI6_MOSI: D8.2 J8.16 ; also sheet 2
PG15: D10.2 J8.22 ; also sheet 2
PH2: D15.8 J3.23 ; also sheet 2
PH3: D15.7 J3.24 ; also sheet 2
PH5: D15.5 J3.25 ; also sheet 2
PH6: D15.4 J3.26 ; also sheet 2
PH9: D15.1 J3.27 ; also sheet 2
PH10_TIM5_CH1: D13.8 J3.35 ; also sheet 2
PH11_TIM5_CH2: D13.7 J3.36 ; also sheet 2
PH12_TIM5_CH3: D13.5 J3.37 ; also sheet 2
PH14: D15.2 J3.28 ; also sheet 2
PH15: D8.8 J8.11 ; also sheet 2
PI0_SPI2_NSS: D4.5 J8.8 ; also sheet 2
PI1_SPI2_SCK: D4.4 J8.7 ; also sheet 2
PI2_SPI2_MISO: D4.1 J8.9 ; also sheet 2
PI3_SPI2_MOSI: D4.2 J8.10 ; also sheet 2
PI4: D7.7 J9.34 ; also sheet 2
PI8: D12.8 J8.35 ; also sheet 2
PI10: D7.1 J9.37 ; also sheet 2
PI11: D12.7 J8.36 ; also sheet 2
V1.8A: J12.1 J12.2 ; also sheet 1,2
V3.3A: J12.5 J12.6 ; also sheet 1,2,3
V3.3D: J12.9 J12.10 ; also sheet 1,2
V5D: J3.5 J3.6 J8.5 J8.6 J9.5 J9.6 J12.13 J12.14 ; also sheet 1,2
VCC: J12.17 J12.18 ; also sheet 1

### Notes on the sheet
- DIGITAL I/O
- MBUS-SDA | MBUS-SCL | POWER
- DIO0 | DIO1
- DIO2 | DIO3
- DIO4 | DIO5
- DIO6 | DIO7
- DIO8 | DIO9
- DIO10 | DIO11
- DIO12 | DIO13
- DIO14 | DIO15
- DIO16 | DIO17
- DIO18 | DIO19
- DIO20 | DIO21
- DIO22/TMR0.0 | DIO23/TMR0.1
- DIO24/TMR1.0 | DIO25/TMR1.1
- DIO26TMR2.0 | DIO27/TMR2.1
- DIO28/TMR3.0 | DIO29/TMR3.1
- DIO30/TMR3.2 | DIO31/TMR4.0
- SERIAL
- MBUS-SDA | MBUS-SCL
- DIO32/SPI0-SCK | DIO33/SPI0-NSS
- DIO34/SPI0-MISO | DIO35/SPI0-MOSI
- DIO36 | DIO37
- DIO38/SPI1-SCK | DIO39/SPI1-NSS
- DIO40/SPI1-MISO | DIO41/SPI1-MOSI
- DIO42 | DIO43
- DIO44/I2C0-SDA | DIO45/I2C0-SCL
- DIO46 | DIO47
- DIO48/UART0-TX | DIO49/UART0-RX
- DIO50 | DIO51
- DIO52/UART1-TX | DIO53/UART1-RX
- DIO54/UART1-CTS | DIO55/UART1-RTS
- DIO56/UART2-TX | DIO57/UART2-RX
- DIO58/UART2-CTS | DIO59/UART2-RTS
- DIO60 | DIO61
- CAN0_L | CAN0_H
- ANALOG
- MBUS-SDA | MBUS-SCL
- DAC0 | DAC1
- DAC2 | DAC3
- DAC-HS
- ADC0.0 | ADC1.0
- ADC0.1 | ADC1.1
- ADC0.2 | ADC1.2
- ADC0.3 | ADC1.3
- ADC0.4 | ADC1.4
- ADC0.5 | ADC1.5
- ADC0.6 | ADC1.6
- GND connections for TVS Diodes
- DIO62 | DIO63
- DIO64 | DIO65
- DIO66 | DIO67
- DIO68 | DIO69